# EAGLE schematic DarkScope (EAGLE 9.0.0)

## Sheet 1 of 19
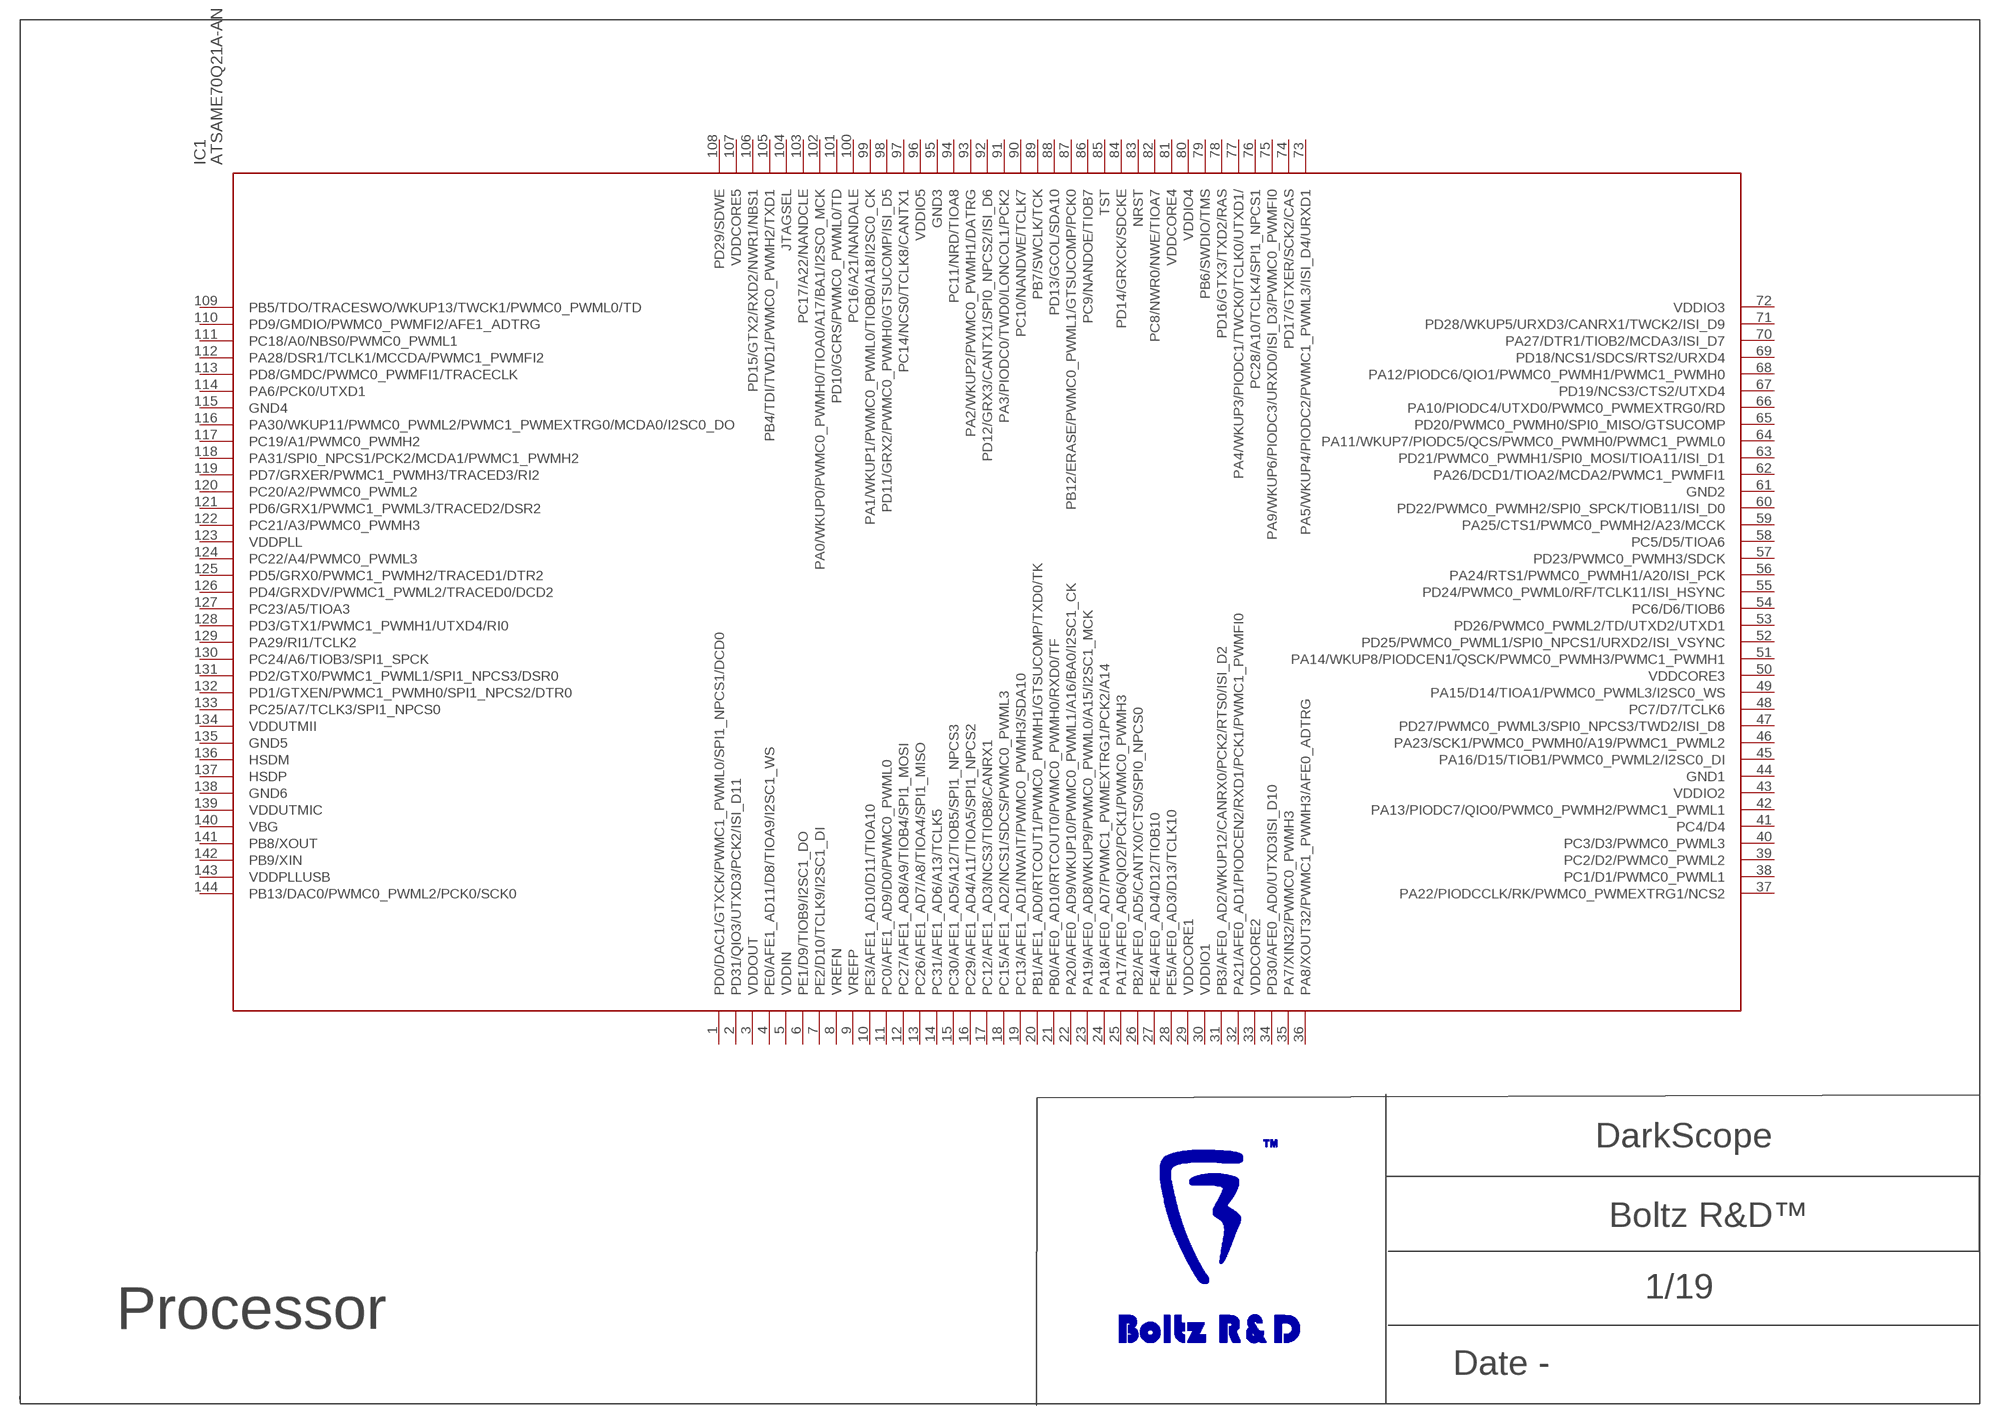
[diagram p0: schematic, sheet 1]

### Parts
IC1  ATSAME70Q21A-AN  [QFP50P2200X2200X160-144N]
Unconnected: IC1.1(PD0/DAC1/GTXCK/PWMC1_PWML0/SPI1_NPCS1/DCD0) IC1.2(PD31/QIO3/UTXD3/PCK2/ISI_D11) IC1.4(PE0/AFE1_AD11/D8/TIOA9/I2SC1_WS) IC1.6(PE1/D9/TIOB9/I2SC1_DO) IC1.7(PE2/D10/TCLK9/I2SC1_DI) IC1.8(VREFN) IC1.9(VREFP) IC1.10(PE3/AFE1_AD10/D11/TIOA10) IC1.11(PC0/AFE1_AD9/D0/PWMC0_PWML0) IC1.12(PC27/AFE1_AD8/A9/TIOB4/SPI1_MOSI) IC1.13(PC26/AFE1_AD7/A8/TIOA4/SPI1_MISO) IC1.14(PC31/AFE1_AD6/A13/TCLK5) IC1.15(PC30/AFE1_AD5/A12/TIOB5/SPI1_NPCS3) IC1.16(PC29/AFE1_AD4/A11/TIOA5/SPI1_NPCS2) IC1.17(PC12/AFE1_AD3/NCS3/TIOB8/CANRX1) IC1.18(PC15/AFE1_AD2/NCS1/SDCS/PWMC0_PWML3) IC1.19(PC13/AFE1_AD1/NWAIT/PWMC0_PWMH3/SDA10) IC1.20(PB1/AFE1_AD0/RTCOUT1/PWMC0_PWMH1/GTSUCOMP/TXD0/TK) IC1.21(PB0/AFE0_AD10/RTCOUT0/PWMC0_PWMH0/RXD0/TF) IC1.22(PA20/AFE0_AD9/WKUP10/PWMC0_PWML1/A16/BA0/I2SC1_CK) IC1.23(PA19/AFE0_AD8/WKUP9/PWMC0_PWML0/A15/I2SC1_MCK) IC1.24(PA18/AFE0_AD7/PWMC1_PWMEXTRG1/PCK2/A14) IC1.25(PA17/AFE0_AD6/QIO2/PCK1/PWMC0_PWMH3) IC1.26(PB2/AFE0_AD5/CANTX0/CTS0/SPI0_NPCS0) IC1.27(PE4/AFE0_AD4/D12/TIOB10) IC1.28(PE5/AFE0_AD3/D13/TCLK10) IC1.31(PB3/AFE0_AD2/WKUP12/CANRX0/PCK2/RTS0/ISI_D2) IC1.32(PA21/AFE0_AD1/PIODCEN2/RXD1/PCK1/PWMC1_PWMFI0) IC1.34(PD30/AFE0_AD0/UTXD3ISI_D10) IC1.35(PA7/XIN32/PWMC0_PWMH3) IC1.36(PA8/XOUT32/PWMC1_PWMH3/AFE0_ADTRG) IC1.37(PA22/PIODCCLK/RK/PWMC0_PWMEXTRG1/NCS2) IC1.38(PC1/D1/PWMC0_PWML1) IC1.39(PC2/D2/PWMC0_PWML2) IC1.40(PC3/D3/PWMC0_PWML3) IC1.41(PC4/D4) IC1.42(PA13/PIODC7/QIO0/PWMC0_PWMH2/PWMC1_PWML1) IC1.45(PA16/D15/TIOB1/PWMC0_PWML2/I2SC0_DI) IC1.46(PA23/SCK1/PWMC0_PWMH0/A19/PWMC1_PWML2) IC1.47(PD27/PWMC0_PWML3/SPI0_NPCS3/TWD2/ISI_D8) IC1.48(PC7/D7/TCLK6) IC1.49(PA15/D14/TIOA1/PWMC0_PWML3/I2SC0_WS) IC1.51(PA14/WKUP8/PIODCEN1/QSCK/PWMC0_PWMH3/PWMC1_PWMH1) IC1.52(PD25/PWMC0_PWML1/SPI0_NPCS1/URXD2/ISI_VSYNC) IC1.53(PD26/PWMC0_PWML2/TD/UTXD2/UTXD1) IC1.54(PC6/D6/TIOB6) IC1.55(PD24/PWMC0_PWML0/RF/TCLK11/ISI_HSYNC) IC1.56(PA24/RTS1/PWMC0_PWMH1/A20/ISI_PCK) IC1.57(PD23/PWMC0_PWMH3/SDCK) IC1.58(PC5/D5/TIOA6) IC1.59(PA25/CTS1/PWMC0_PWMH2/A23/MCCK) IC1.60(PD22/PWMC0_PWMH2/SPI0_SPCK/TIOB11/ISI_D0) IC1.62(PA26/DCD1/TIOA2/MCDA2/PWMC1_PWMFI1) IC1.63(PD21/PWMC0_PWMH1/SPI0_MOSI/TIOA11/ISI_D1) IC1.64(PA11/WKUP7/PIODC5/QCS/PWMC0_PWMH0/PWMC1_PWML0) IC1.65(PD20/PWMC0_PWMH0/SPI0_MISO/GTSUCOMP) IC1.66(PA10/PIODC4/UTXD0/PWMC0_PWMEXTRG0/RD) IC1.67(PD19/NCS3/CTS2/UTXD4) IC1.68(PA12/PIODC6/QIO1/PWMC0_PWMH1/PWMC1_PWMH0) IC1.69(PD18/NCS1/SDCS/RTS2/URXD4) IC1.70(PA27/DTR1/TIOB2/MCDA3/ISI_D7) IC1.71(PD28/WKUP5/URXD3/CANRX1/TWCK2/ISI_D9) IC1.73(PA5/WKUP4/PIODC2/PWMC1_PWML3/ISI_D4/URXD1) IC1.74(PD17/GTXER/SCK2/CAS) IC1.75(PA9/WKUP6/PIODC3/URXD0/ISI_D3/PWMC0_PWMFI0) IC1.76(PC28/A10/TCLK4/SPI1_NPCS1) IC1.77(PA4/WKUP3/PIODC1/TWCK0/TCLK0/UTXD1/) IC1.78(PD16/GTX3/TXD2/RAS) IC1.79(PB6/SWDIO/TMS) IC1.82(PC8/NWR0/NWE/TIOA7) IC1.83(NRST) IC1.84(PD14/GRXCK/SDCKE) IC1.85(TST) IC1.86(PC9/NANDOE/TIOB7) IC1.87(PB12/ERASE/PWMC0_PWML1/GTSUCOMP/PCK0) IC1.88(PD13/GCOL/SDA10) IC1.89(PB7/SWCLK/TCK) IC1.90(PC10/NANDWE/TCLK7) IC1.91(PA3/PIODC0/TWD0/LONCOL1/PCK2) IC1.92(PD12/GRX3/CANTX1/SPI0_NPCS2/ISI_D6) IC1.93(PA2/WKUP2/PWMC0_PWMH1/DATRG) IC1.94(PC11/NRD/TIOA8) IC1.97(PC14/NCS0/TCLK8/CANTX1) IC1.98(PD11/GRX2/PWMC0_PWMH0/GTSUCOMP/ISI_D5) IC1.99(PA1/WKUP1/PWMC0_PWML0/TIOB0/A18/I2SC0_CK) IC1.100(PC16/A21/NANDALE) IC1.101(PD10/GCRS/PWMC0_PWML0/TD) IC1.102(PA0/WKUP0/PWMC0_PWMH0/TIOA0/A17/BA1/I2SC0_MCK) IC1.103(PC17/A22/NANDCLE) IC1.104(JTAGSEL) IC1.105(PB4/TDI/TWD1/PWMC0_PWMH2/TXD1) IC1.106(PD15/GTX2/RXD2/NWR1/NBS1) IC1.108(PD29/SDWE) IC1.109(PB5/TDO/TRACESWO/WKUP13/TWCK1/PWMC0_PWML0/TD) IC1.110(PD9/GMDIO/PWMC0_PWMFI2/AFE1_ADTRG) IC1.111(PC18/A0/NBS0/PWMC0_PWML1) IC1.112(PA28/DSR1/TCLK1/MCCDA/PWMC1_PWMFI2) IC1.113(PD8/GMDC/PWMC0_PWMFI1/TRACECLK) IC1.114(PA6/PCK0/UTXD1) IC1.116(PA30/WKUP11/PWMC0_PWML2/PWMC1_PWMEXTRG0/MCDA0/I2SC0_DO) IC1.117(PC19/A1/PWMC0_PWMH2) IC1.118(PA31/SPI0_NPCS1/PCK2/MCDA1/PWMC1_PWMH2) IC1.119(PD7/GRXER/PWMC1_PWMH3/TRACED3/RI2) IC1.120(PC20/A2/PWMC0_PWML2) IC1.121(PD6/GRX1/PWMC1_PWML3/TRACED2/DSR2) IC1.122(PC21/A3/PWMC0_PWMH3) IC1.124(PC22/A4/PWMC0_PWML3) IC1.125(PD5/GRX0/PWMC1_PWMH2/TRACED1/DTR2) IC1.126(PD4/GRXDV/PWMC1_PWML2/TRACED0/DCD2) IC1.127(PC23/A5/TIOA3) IC1.128(PD3/GTX1/PWMC1_PWMH1/UTXD4/RI0) IC1.129(PA29/RI1/TCLK2) IC1.130(PC24/A6/TIOB3/SPI1_SPCK) IC1.131(PD2/GTX0/PWMC1_PWML1/SPI1_NPCS3/DSR0) IC1.132(PD1/GTXEN/PWMC1_PWMH0/SPI1_NPCS2/DTR0) IC1.133(PC25/A7/TCLK3/SPI1_NPCS0) IC1.136(HSDM) IC1.137(HSDP) IC1.140(VBG) IC1.141(PB8/XOUT) IC1.142(PB9/XIN) IC1.144(PB13/DAC0/PWMC0_PWML2/PCK0/SCK0)

### Notes on the sheet
- Processor

## Sheet 2 of 19
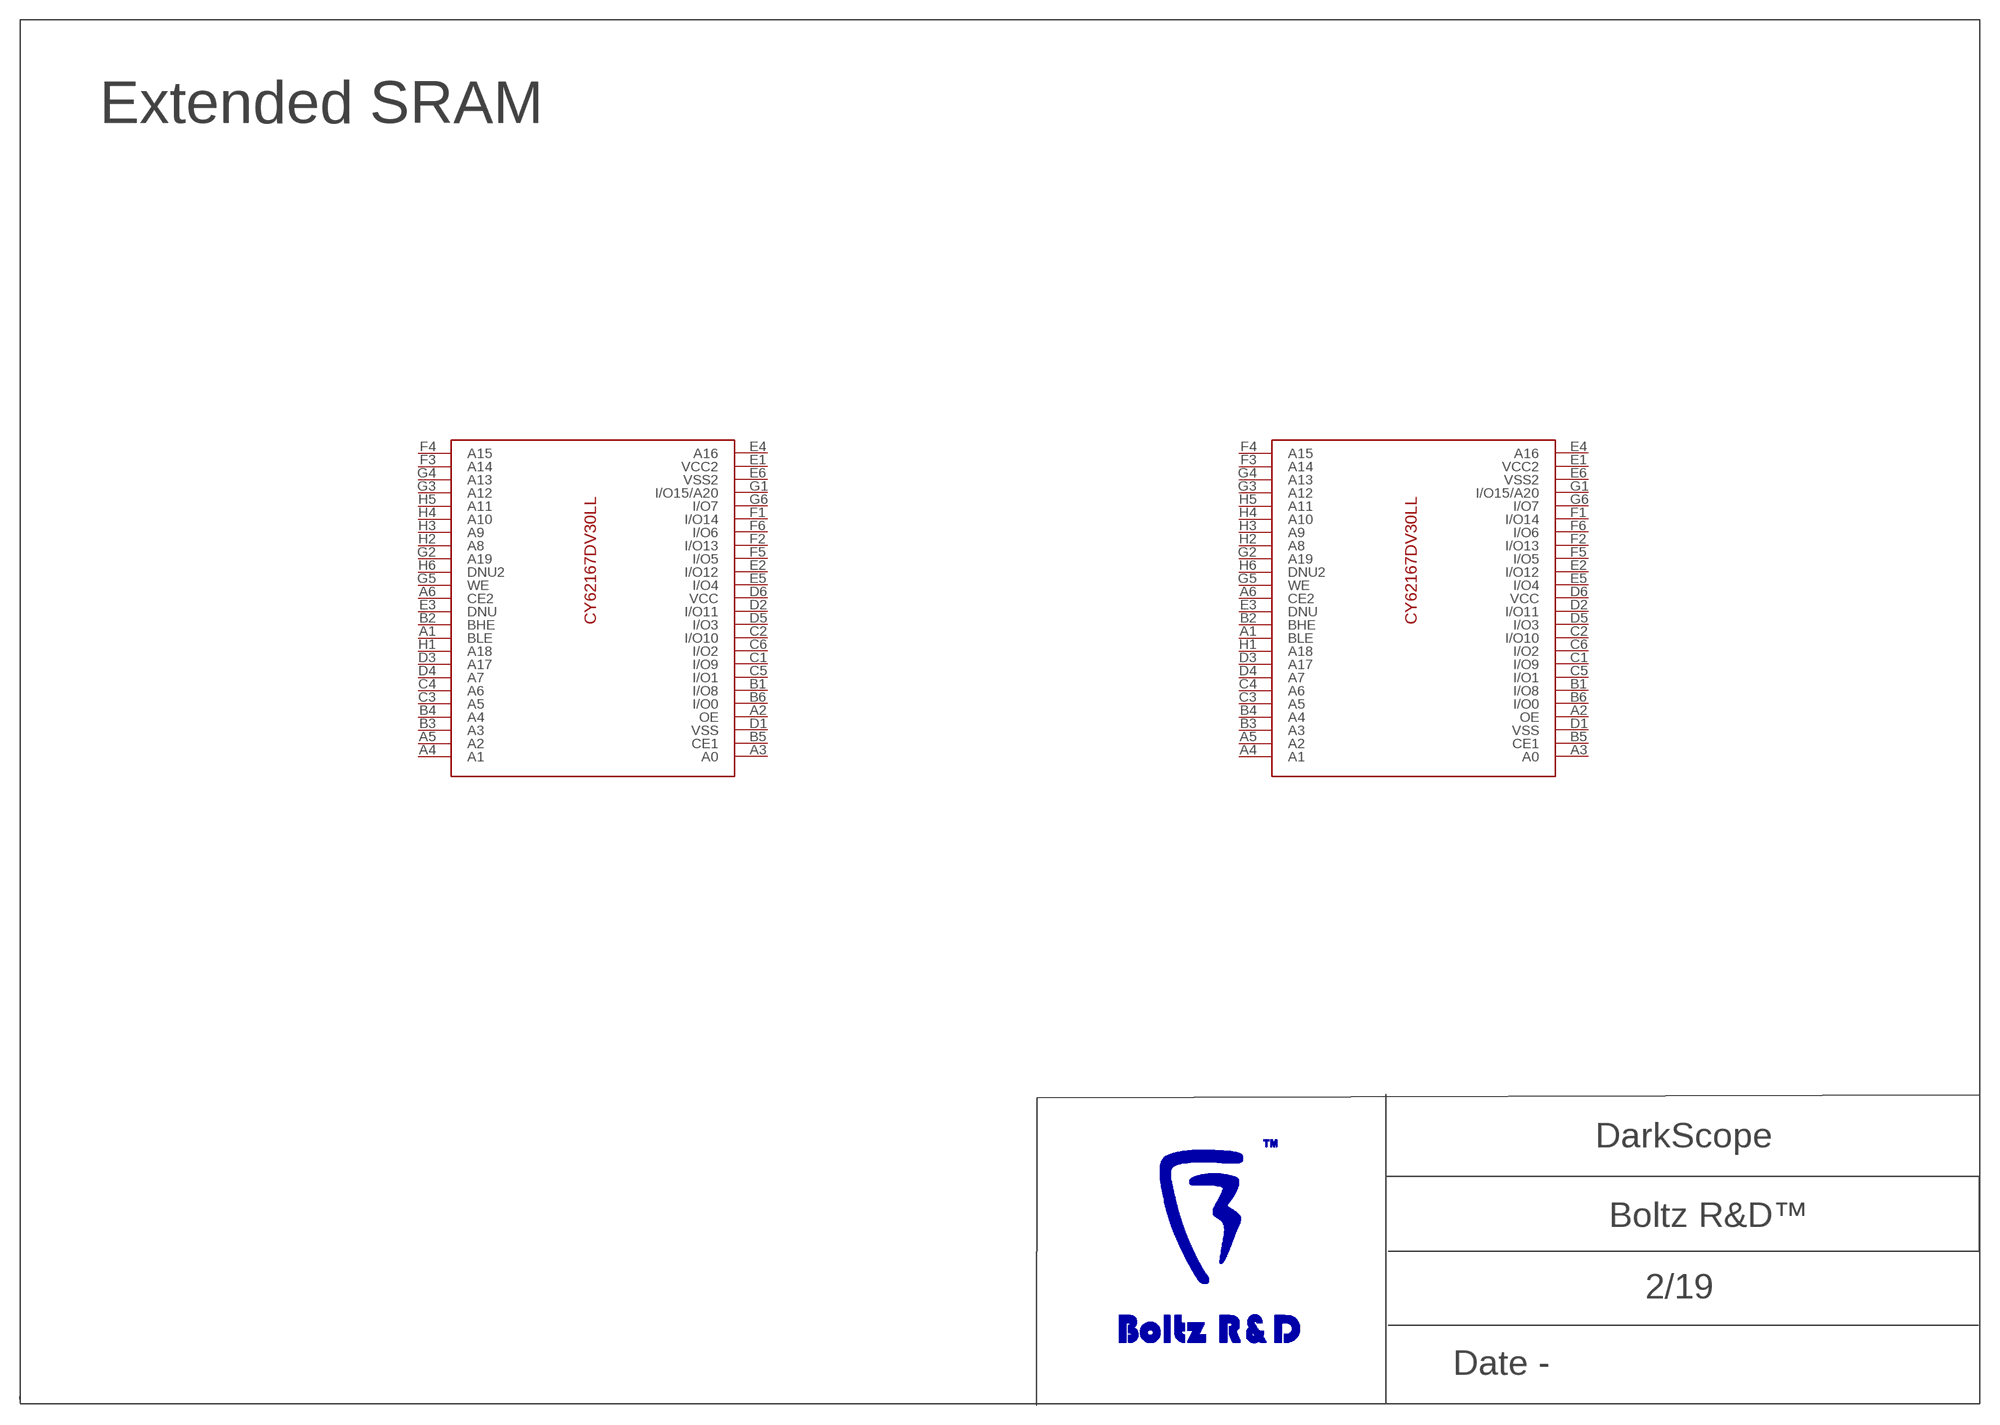
[diagram p1: schematic, sheet 2]

### Parts
U$22  CY62167DV30LLCY62167DV30LL-55BVI  [BGA48C75P6X8_950X800X100]
U$23  CY62167DV30LLCY62167DV30LL-55BVI  [BGA48C75P6X8_950X800X100]
Unconnected: U$22.A1(BLE) U$22.A2(OE) U$22.A3(A0) U$22.A4(A1) U$22.A5(A2) U$22.A6(CE2) U$22.B1(I/O8) U$22.B2(BHE) U$22.B3(A3) U$22.B4(A4) U$22.B5(CE1) U$22.B6(I/O0) U$22.C1(I/O9) U$22.C2(I/O10) U$22.C3(A5) U$22.C4(A6) U$22.C5(I/O1) U$22.C6(I/O2) U$22.D1(VSS) U$22.D2(I/O11) U$22.D3(A17) U$22.D4(A7) U$22.D5(I/O3) U$22.D6(VCC) U$22.E1(VCC2) U$22.E2(I/O12) U$22.E3(DNU) U$22.E4(A16) U$22.E5(I/O4) U$22.E6(VSS2) U$22.F1(I/O14) U$22.F2(I/O13) U$22.F3(A14) U$22.F4(A15) U$22.F5(I/O5) U$22.F6(I/O6) U$22.G1(I/O15/A20) U$22.G2(A19) U$22.G3(A12) U$22.G4(A13) U$22.G5(WE) U$22.G6(I/O7) U$22.H1(A18) U$22.H2(A8) U$22.H3(A9) U$22.H4(A10) U$22.H5(A11) U$22.H6(DNU2) U$23.A1(BLE) U$23.A2(OE) U$23.A3(A0) U$23.A4(A1) U$23.A5(A2) U$23.A6(CE2) U$23.B1(I/O8) U$23.B2(BHE) U$23.B3(A3) U$23.B4(A4) U$23.B5(CE1) U$23.B6(I/O0) U$23.C1(I/O9) U$23.C2(I/O10) U$23.C3(A5) U$23.C4(A6) U$23.C5(I/O1) U$23.C6(I/O2) U$23.D1(VSS) U$23.D2(I/O11) U$23.D3(A17) U$23.D4(A7) U$23.D5(I/O3) U$23.D6(VCC) U$23.E1(VCC2) U$23.E2(I/O12) U$23.E3(DNU) U$23.E4(A16) U$23.E5(I/O4) U$23.E6(VSS2) U$23.F1(I/O14) U$23.F2(I/O13) U$23.F3(A14) U$23.F4(A15) U$23.F5(I/O5) U$23.F6(I/O6) U$23.G1(I/O15/A20) U$23.G2(A19) U$23.G3(A12) U$23.G4(A13) U$23.G5(WE) U$23.G6(I/O7) U$23.H1(A18) U$23.H2(A8) U$23.H3(A9) U$23.H4(A10) U$23.H5(A11) U$23.H6(DNU2)

### Notes on the sheet
- Extended SRAM

## Sheet 3 of 19
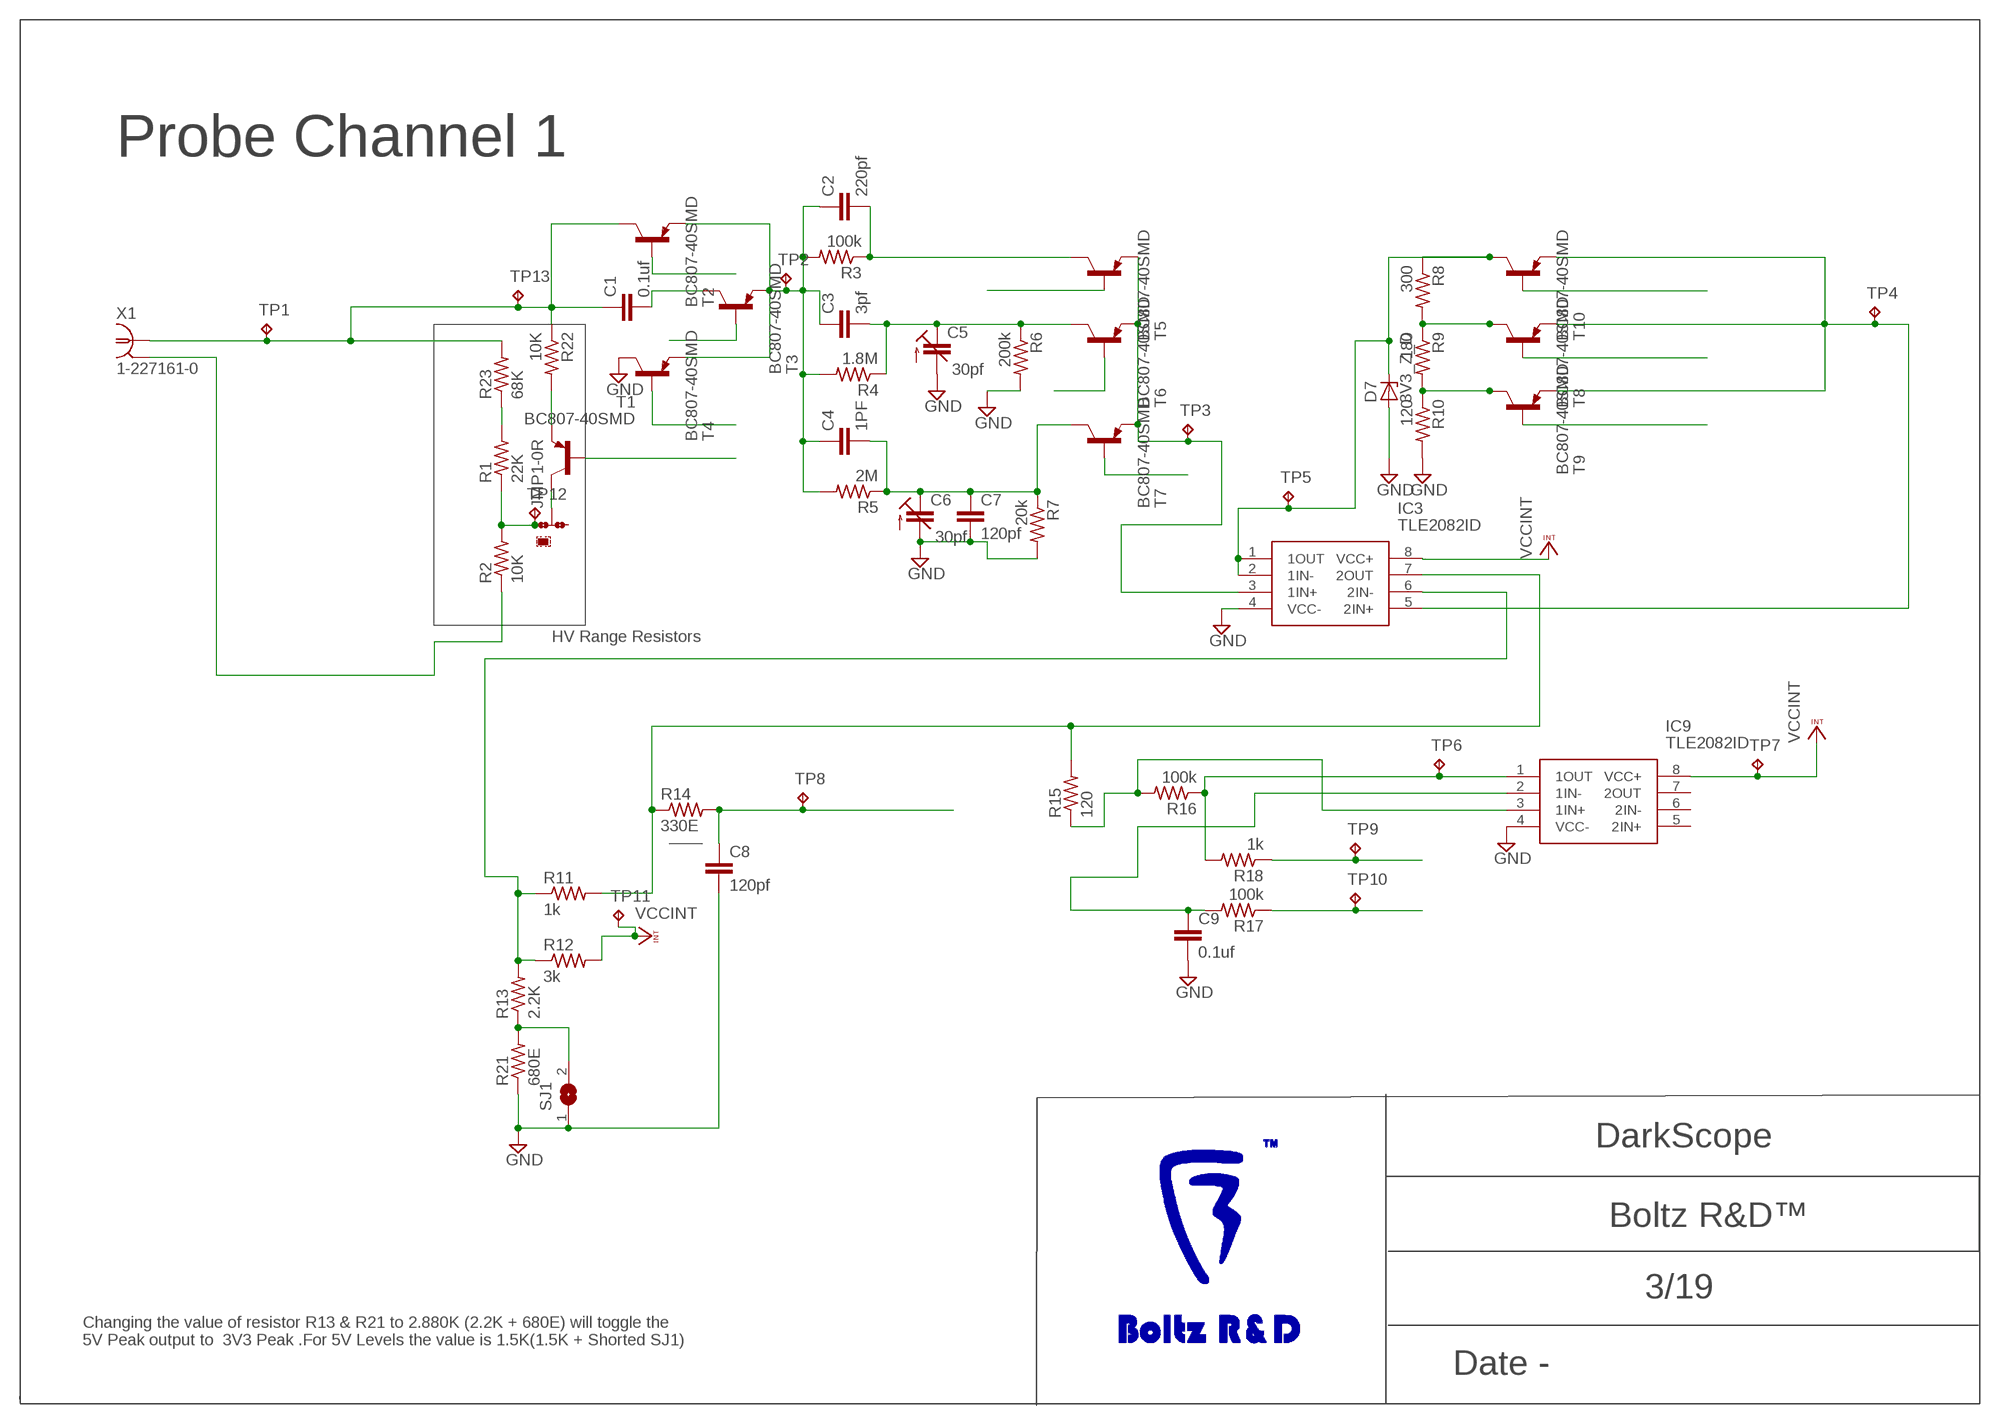
[diagram p2: schematic, sheet 3]

### Parts
C1  0.1uf  C-EUC0603  [C0603]
C2  220pf  C-EUC0603  [C0603]
C3  3pf  C-EUC0603  [C0603]
C4  1PF  C-EUC0603  [C0603]
C5  30pf  C-TRIMM3018_11  [CTRIM3018_11]
C6  30pf  C-TRIMM3018_11  [CTRIM3018_11]
C7  120pf  C-EUC0603  [C0603]
C8  120pf  C-EUC0603  [C0603]
C9  0.1uf  C-EUC0603  [C0603]
D7  3V3_Z_D  ZENER-DIODESOD80C  [SOD80C]
IC3  TLE2082ID  [SOIC127P600X175-8N]
IC9  TLE2082ID  [SOIC127P600X175-8N]
JMP1  0R-JUMPC  [C0R-JMP]
R1  22K  R-US_R0603  [R0603]
R2  10K  R-US_R0603  [R0603]
R3  100k  R-US_R0603  [R0603]
R4  1.8M  R-US_R0603  [R0603]
R5  2M  R-US_R0603  [R0603]
R6  200k  R-US_R0603  [R0603]
R7  20k  R-US_R0603  [R0603]
R8  300  R-US_R0603  [R0603]
R9  180  R-US_R0603  [R0603]
R10  120  R-US_R0603  [R0603]
R11  1k  R-US_R0603  [R0603]
R12  3k  R-US_R0603  [R0603]
R13  2.2K  R-US_R0603  [R0603]
R14  330E  R-US_R0603  [R0603]
R15  120  R-US_R0603  [R0603]
R16  100k  R-US_R0603  [R0603]
R17  100k  R-US_R0603  [R0603]
R18  1k  R-US_R0603  [R0603]
R21  680E  R-US_R0603  [R0603]
R22  10K  R-US_R0603  [R0603]
R23  68K  R-US_R0603  [R0603]
SJ1  SJ  [SJ]
T1  BC807-40SMD  [SOT23-BEC]
T2  BC807-40SMD  [SOT23-BEC]
T3  BC807-40SMD  [SOT23-BEC]
T4  BC807-40SMD  [SOT23-BEC]
T5  BC807-40SMD  [SOT23-BEC]
T6  BC807-40SMD  [SOT23-BEC]
T7  BC807-40SMD  [SOT23-BEC]
T8  BC807-40SMD  [SOT23-BEC]
T9  BC807-40SMD  [SOT23-BEC]
T10  BC807-40SMD  [SOT23-BEC]
TP1  TPTP07R  [TP07R]
TP2  TPTP07R  [TP07R]
TP3  TPTP07R  [TP07R]
TP4  TPTP07R  [TP07R]
TP5  TPTP07R  [TP07R]
TP6  TPTP07R  [TP07R]
TP7  TPTP07R  [TP07R]
TP8  TPTP07R  [TP07R]
TP9  TPTP07R  [TP07R]
TP10  TPTP07R  [TP07R]
TP11  TPTP07R  [TP07R]
TP12  TPTP07R  [TP07R]
TP13  TPTP07R  [TP07R]
X1  1-227161-0  [AMP_227161]

### Nets
+5V/1: IC3.8(VCC+) IC9.8(VCC+) R12.2 TP7.TP TP11.TP ; supply symbol labelled VCCINT ; also sheet 11
GND: C5.-(A) C6.-(A) C7.2 C8.2 C9.2 D7.A IC3.4(VCC-) IC9.4(VCC-) R6.2 R7.2 R10.2 R21.1 SJ1.1 T4.C ; also sheet 9,10,11
N$1: R2.1 X1.2
N$2: JMP1.1 R1.1 R2.2 TP12.TP
N$3: C1.2 T3.C
N$4: T1.B
N$5: R8.2 R9.1 T8.C
N$6: C1.1 R22.1 R23.2 T2.C TP1.TP TP13.TP X1.1
N$7: T10.B
N$8: C2.1 C3.1 C4.1 R3.2 R4.2 R5.2 T2.E T3.E T4.E TP2.TP
N$9: C4.2 C6.+(E) C7.1 R5.1 R7.1 T7.C
N$10: C2.2 R3.1 T5.C
N$11: C3.2 C5.+(E) R4.1 R6.1 T6.C
N$12: R9.2 R10.1 T9.C
N$13: IC3.3(1IN+) T5.E T6.E T7.E TP3.TP
N$15: T5.B
N$16: T6.B
N$17: T7.B
N$18: T4.B
N$19: T3.B
N$20: T2.B
N$21: IC3.5(2IN+) T8.E T9.E T10.E TP4.TP
N$22: IC3.6(2IN-) R11.1 R12.1 R13.2
N$23: IC3.7(2OUT) R11.2 R14.1 R15.2
N$24: C8.1 R14.2 TP8.TP
N$25: IC9.3(1IN+) R15.1 R16.2
N$26: IC9.1(1OUT) R16.1 R18.2 TP6.TP
N$27: C9.1 IC9.2(1IN-) R17.2
N$28: R17.1 TP10.TP
N$29: R18.1 TP9.TP
N$30: D7.C IC3.1(1OUT) IC3.2(1IN-) R8.1 T10.C TP5.TP
N$34: R13.1 R21.2 SJ1.2
N$35: T8.B
N$36: R22.2 T1.E
N$37: R1.2 R23.1
N$38: JMP1.2 T1.C
N$39: T9.B
Unconnected: IC9.5(2IN+) IC9.6(2IN-) IC9.7(2OUT) JMP1.3

### Notes on the sheet
- Probe Channel 1
- HV Range Resistors
- Changing the value of resistor R13 & R21 to 2.880K (2.2K + 680E) will toggle the 
  5V Peak output to  3V3 Peak .For 5V Levels the value is 1.5K(1.5K + Shorted SJ1)

## Sheet 4 of 19

## Sheet 5 of 19

## Sheet 6 of 19

## Sheet 7 of 19
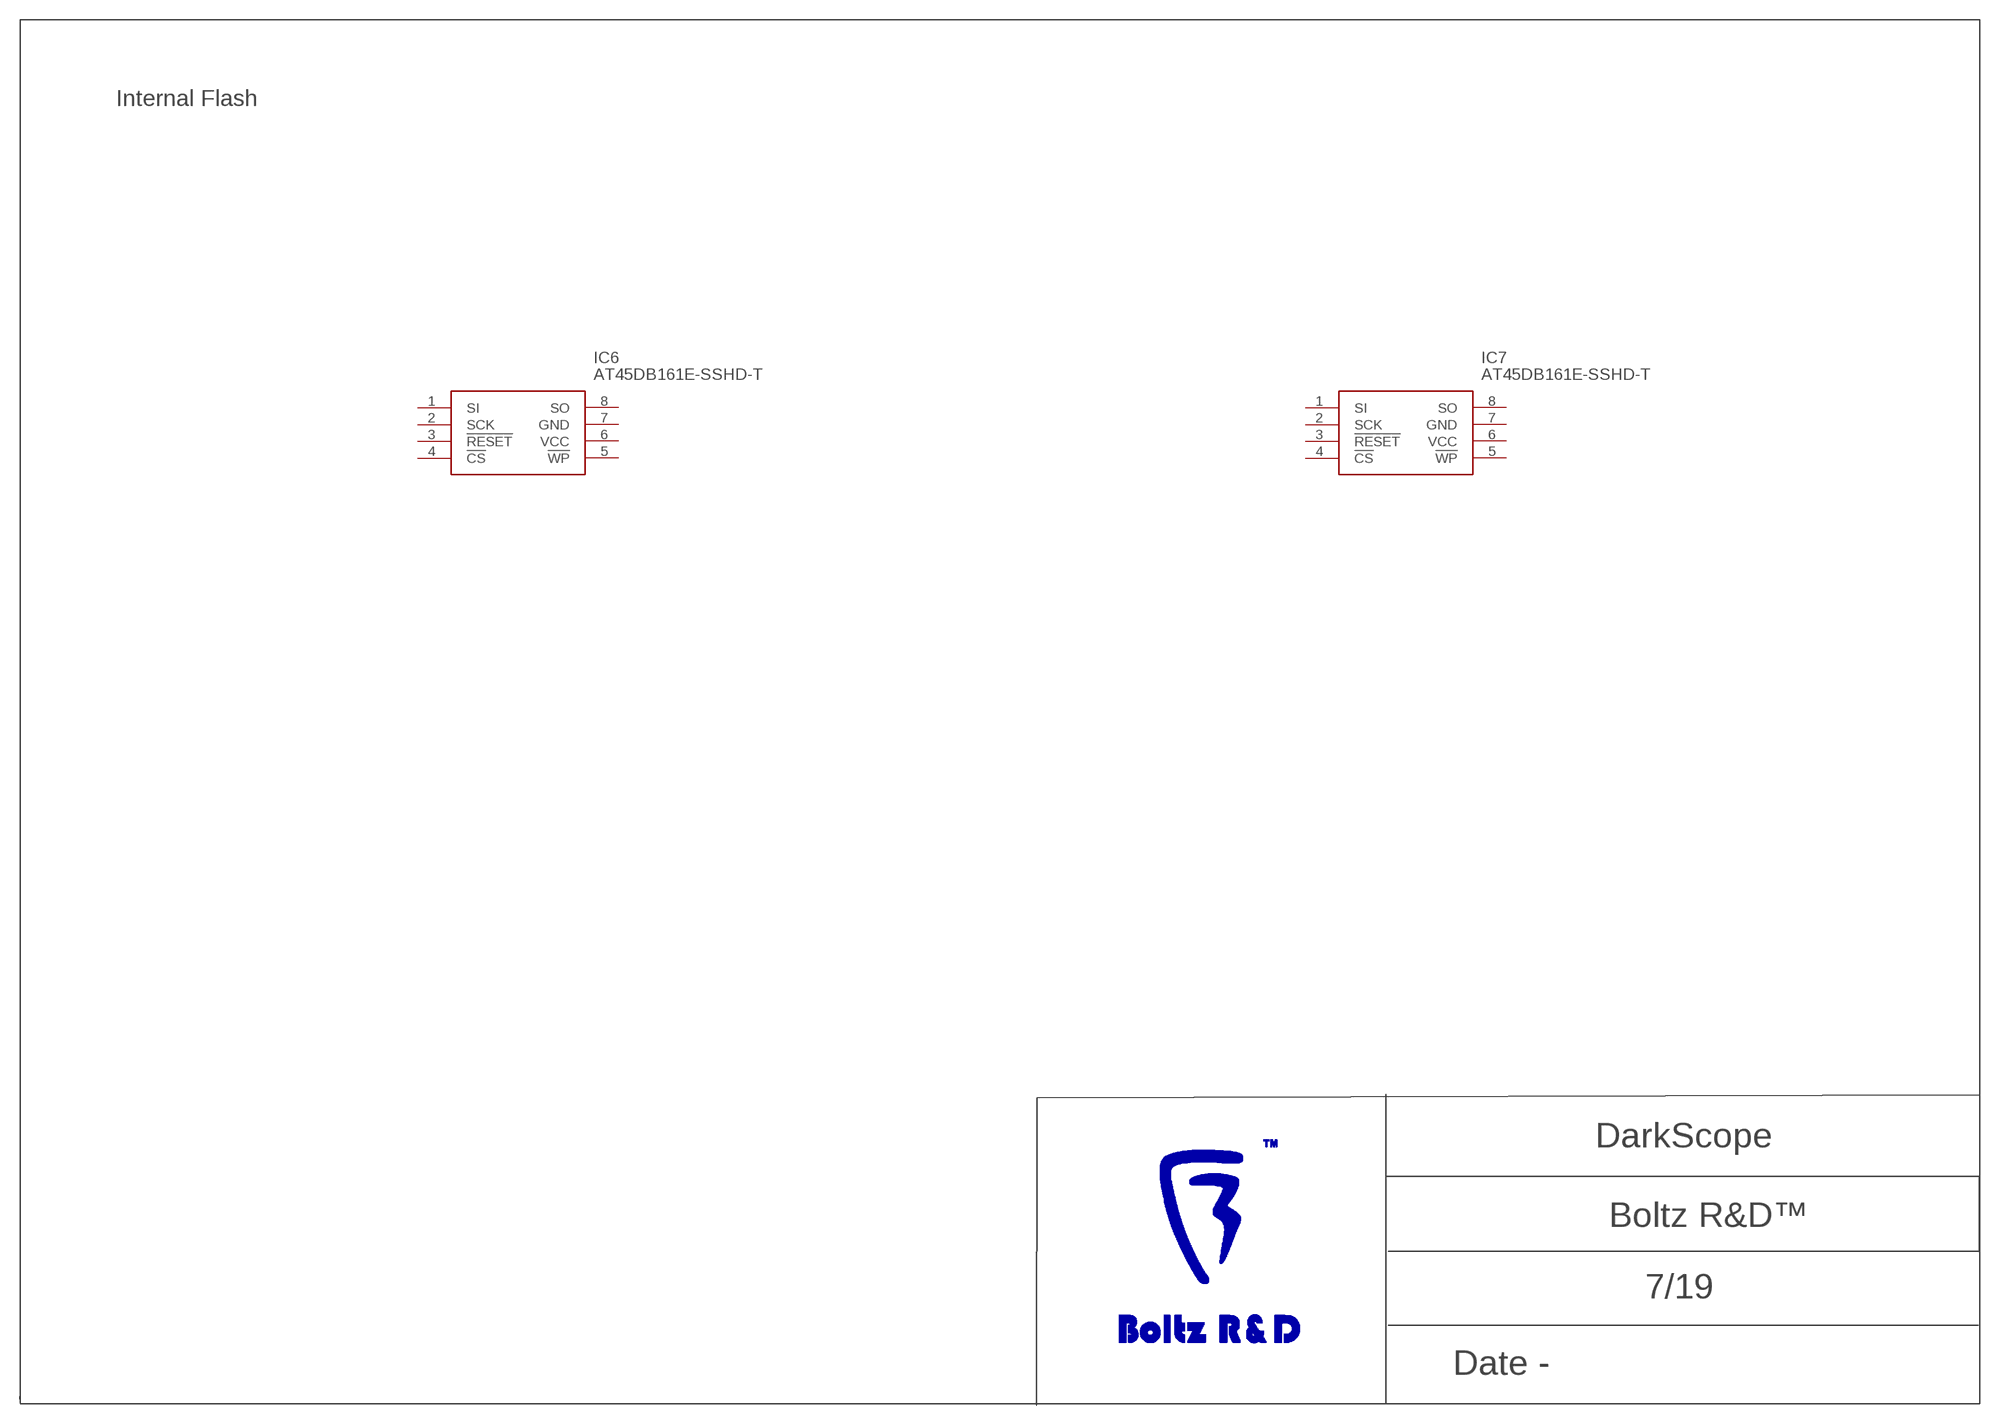
[diagram p3: schematic, sheet 7]

### Parts
IC6  AT45DB161E-SSHD-T  [SOIC127P600X175-8N]
IC7  AT45DB161E-SSHD-T  [SOIC127P600X175-8N]
Unconnected: IC6.1(SI) IC6.2(SCK) IC6.3(!RESET) IC6.4(!CS) IC6.5(!WP) IC6.6(VCC) IC6.7(GND) IC6.8(SO) IC7.1(SI) IC7.2(SCK) IC7.3(!RESET) IC7.4(!CS) IC7.5(!WP) IC7.6(VCC) IC7.7(GND) IC7.8(SO)

### Notes on the sheet
- Internal Flash

## Sheet 8 of 19
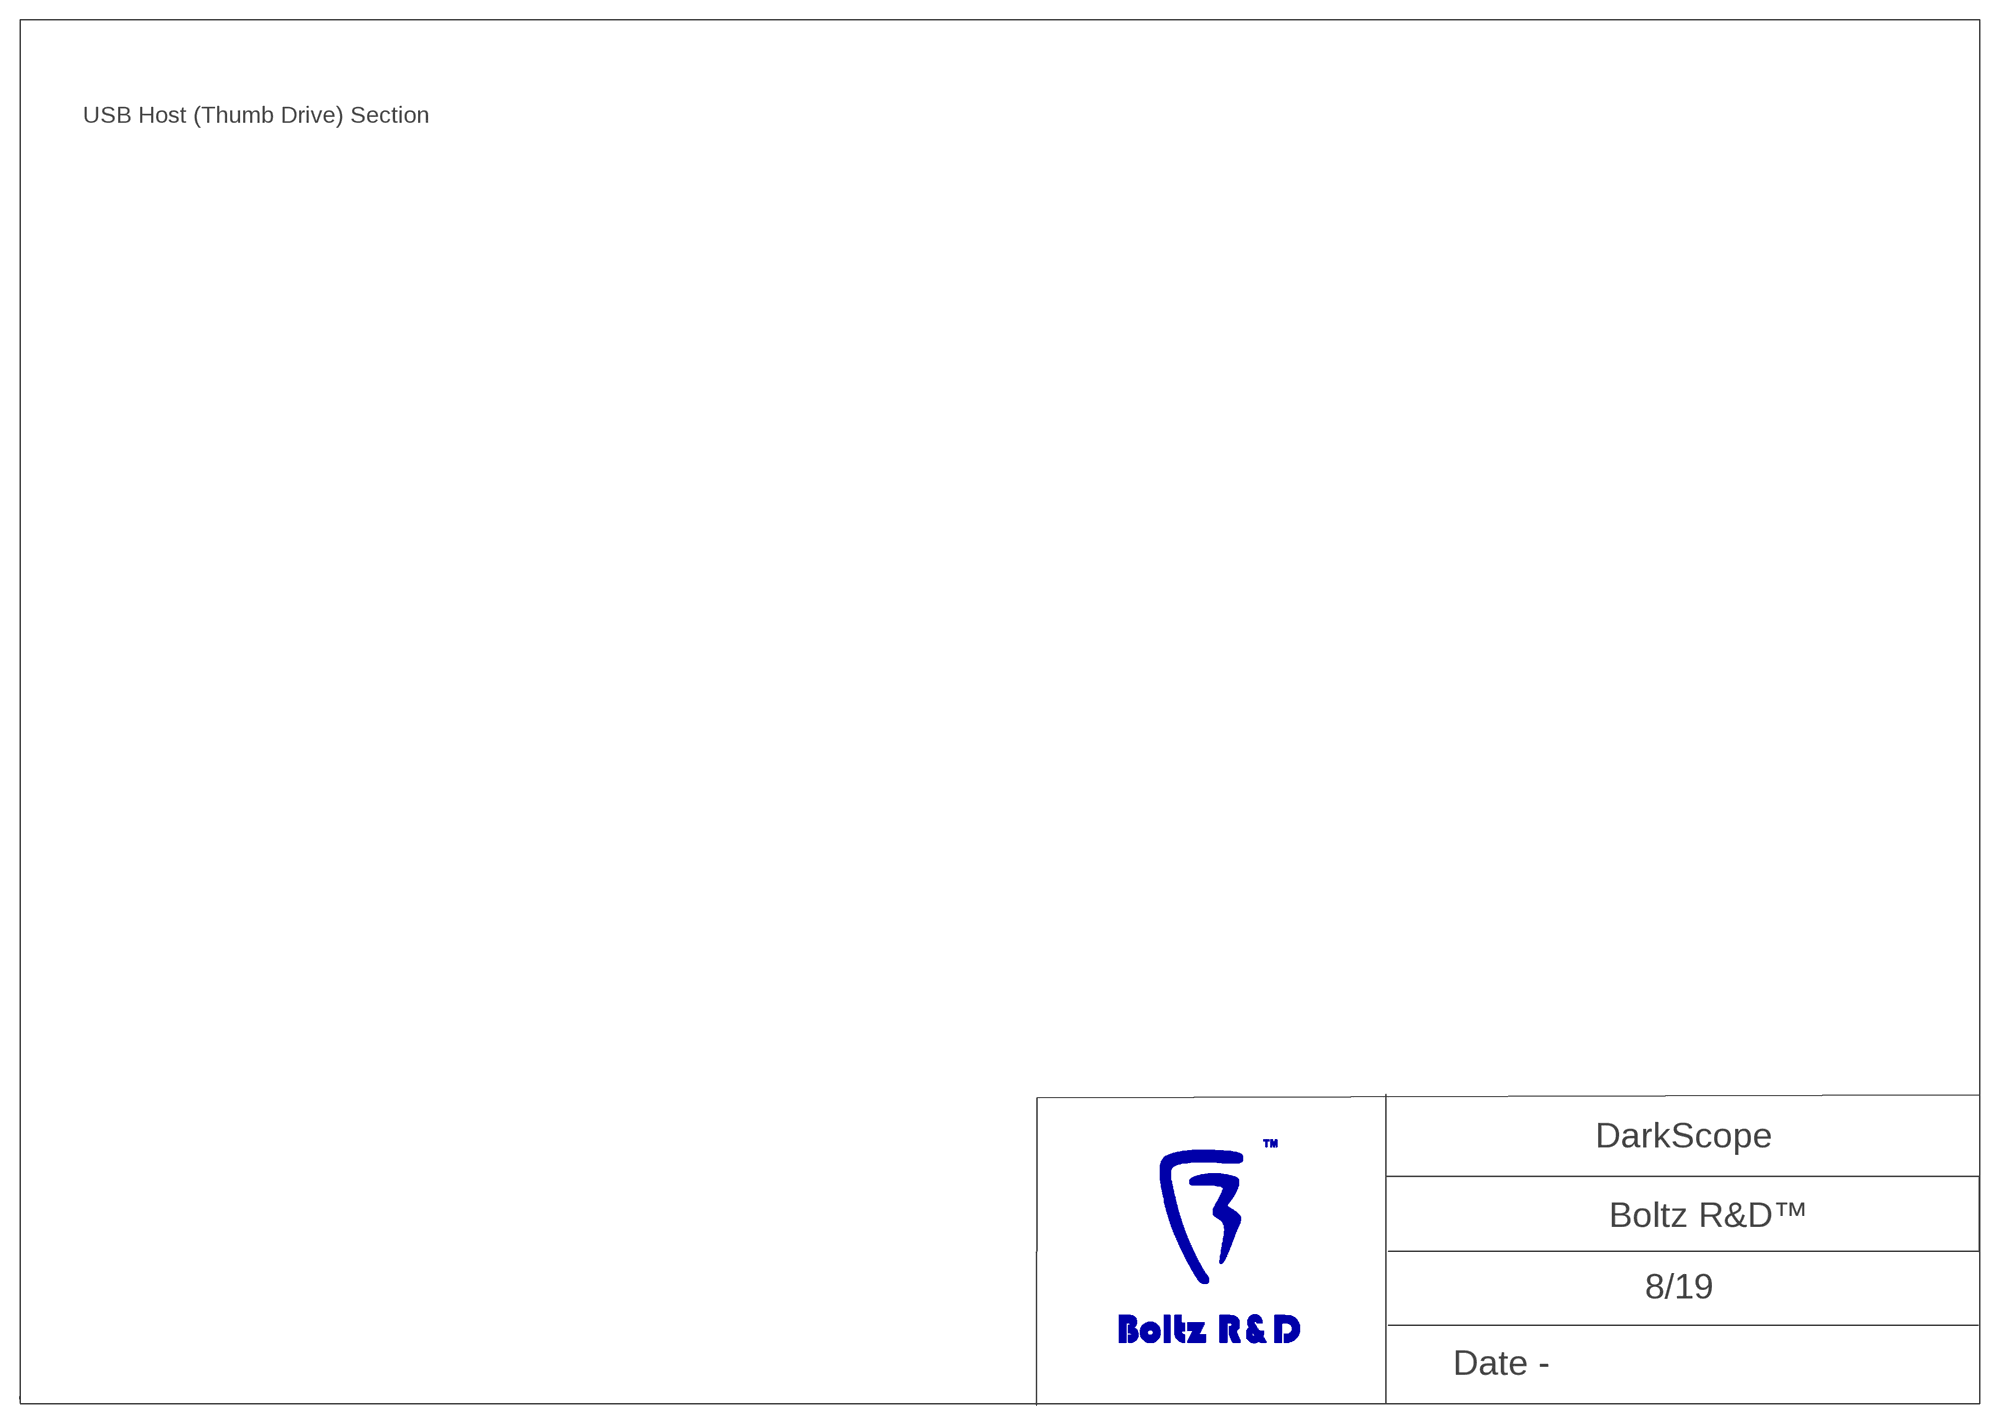
[diagram p4: schematic, sheet 8]

### Notes on the sheet
- USB Host (Thumb Drive) Section

## Sheet 9 of 19
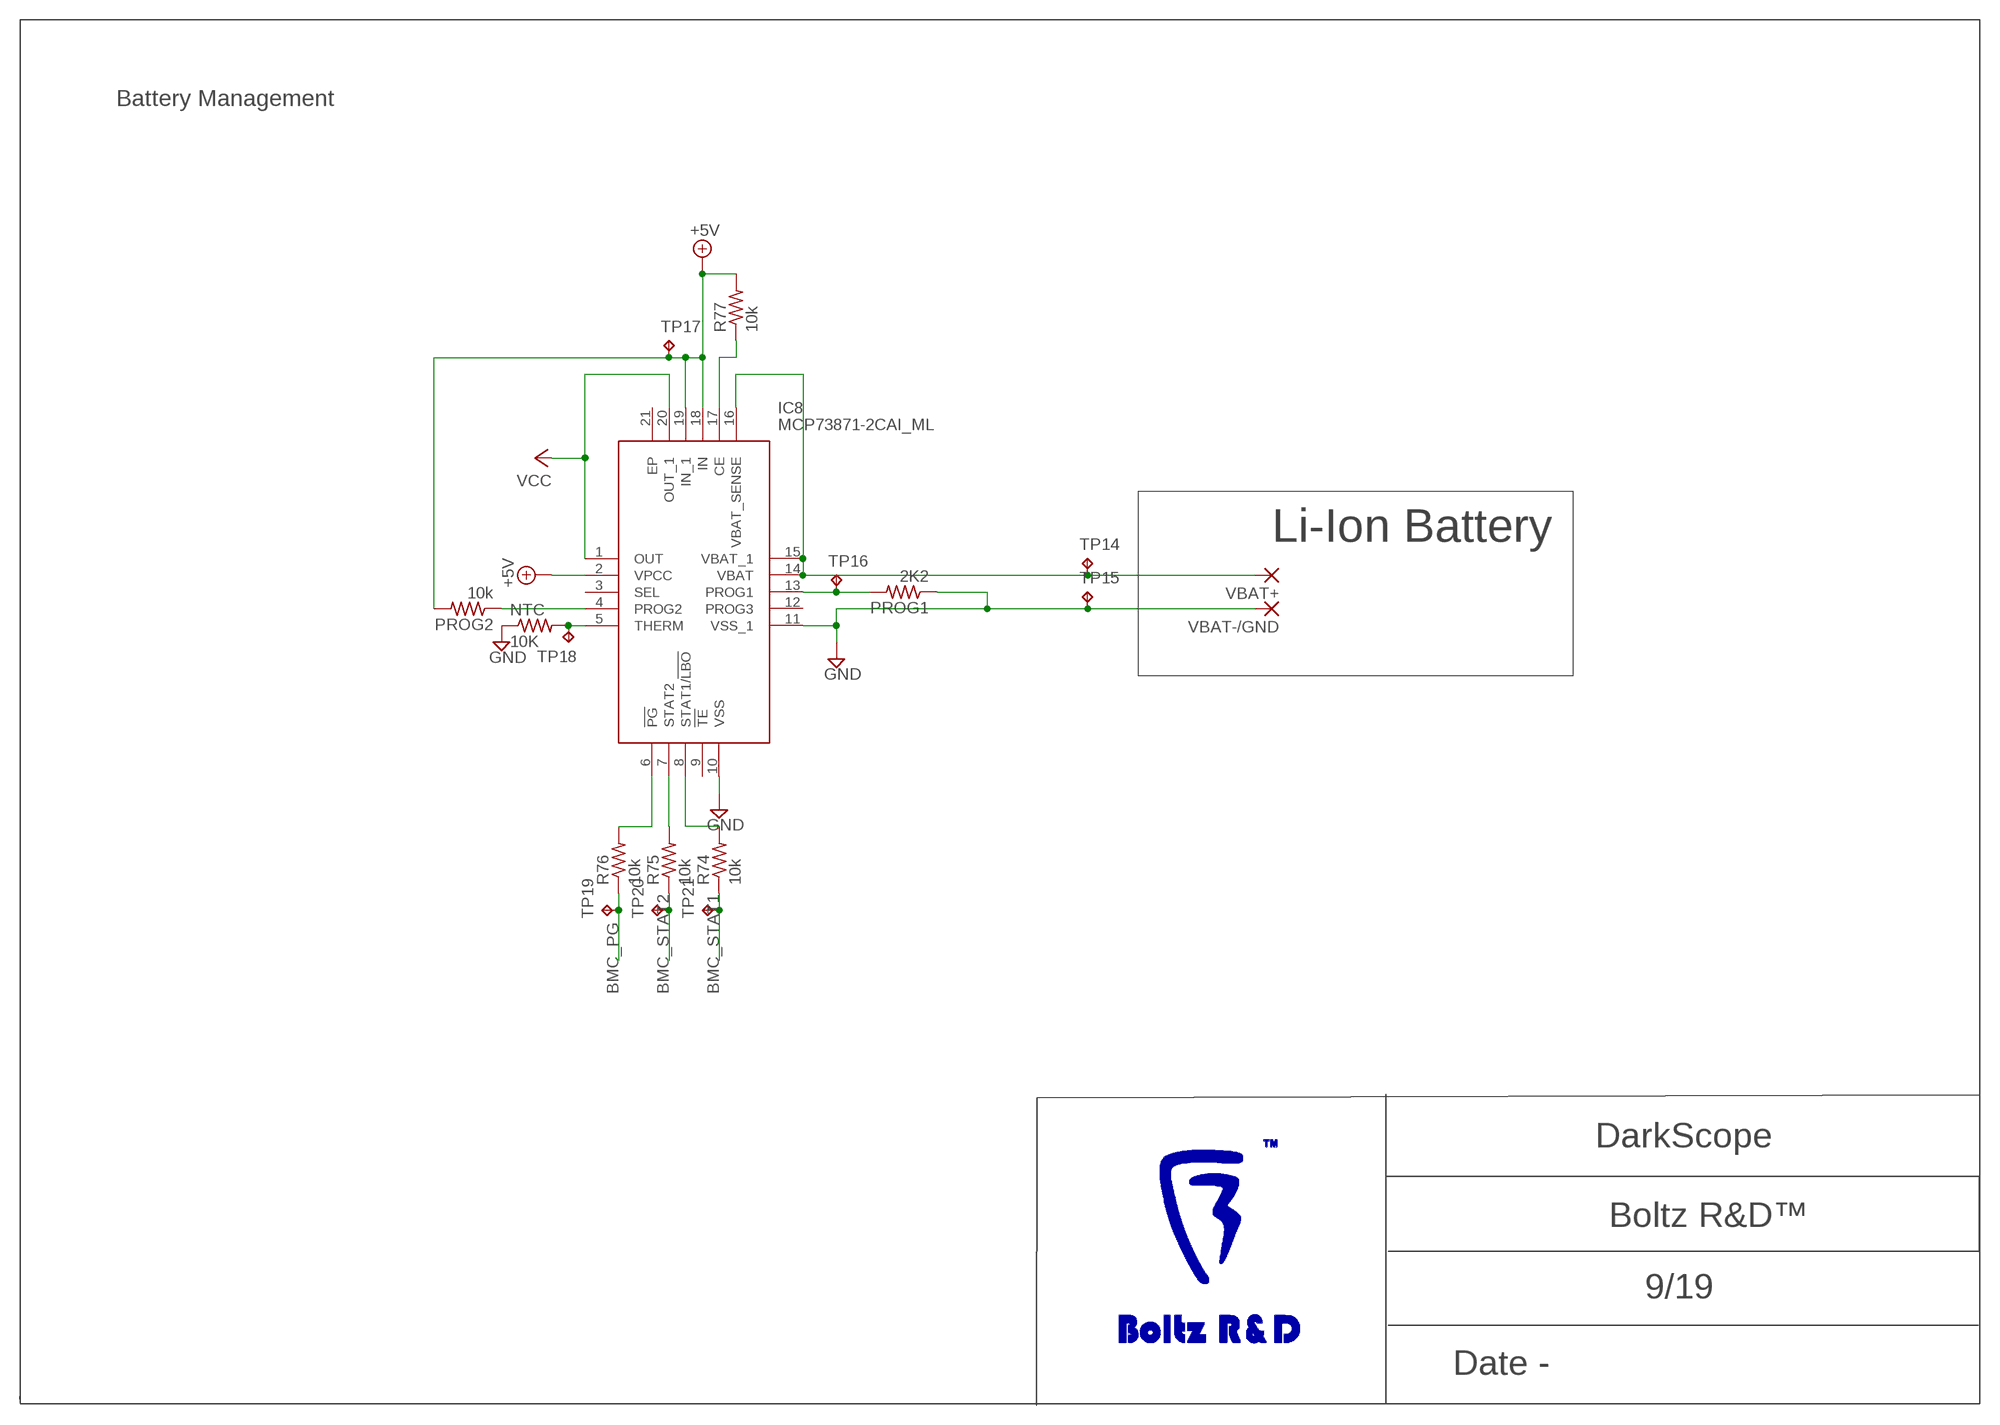
[diagram p5: schematic, sheet 9]

### Parts
IC8  MCP73871-2CAI_ML  [QFN50P400X400X100-21N]
NTC  10K  R-US_R0603  [R0603]
PROG1  2K2  R-US_R0603  [R0603]
PROG2  10k  R-US_R0603  [R0603]
R74  10k  R-US_R0603  [R0603]
R75  10k  R-US_R0603  [R0603]
R76  10k  R-US_R0603  [R0603]
R77  10k  R-US_R0603  [R0603]
TP14  TPTP07R  [TP07R]
TP15  TPTP07R  [TP07R]
TP16  TPTP07R  [TP07R]
TP17  TPTP07R  [TP07R]
TP18  TPTP07R  [TP07R]
TP19  TPTP07R  [TP07R]
TP20  TPTP07R  [TP07R]
TP21  TPTP07R  [TP07R]
VBAT+  SMD5  [SMD2,54-5,08]
VBAT-/GND  SMD5  [SMD2,54-5,08]

### Nets
+5V: IC8.2(VPCC) IC8.18(IN) IC8.19(IN_1) PROG2.2 R77.2 TP17.TP ; also sheet 10
BMC_PG: R76.1 TP19.TP
BMC_STAT1: R74.1 TP21.TP
BMC_STAT2: R75.1 TP20.TP
GND: IC8.10(VSS) IC8.11(VSS_1) PROG1.1 TP15.TP VBAT-/GND.1(P) ; also sheet 3,10,11
N$117: IC8.8(STAT1/!LBO) R74.2
N$118: IC8.5(THERM) NTC.2 TP18.TP
N$119: IC8.6(!PG) R76.2
N$120: IC8.7(STAT2) R75.2
N$121: IC8.13(PROG1) PROG1.2 TP16.TP
N$122: IC8.14(VBAT) IC8.15(VBAT_1) IC8.16(VBAT_SENSE) TP14.TP VBAT+.1(P)
N$123: IC8.4(PROG2) PROG2.1
N$124: IC8.17(CE) R77.1
VCC: IC8.1(OUT) IC8.20(OUT_1) ; also sheet 11
Unconnected: IC8.3(SEL) IC8.9(!TE) IC8.12(PROG3) IC8.21(EP) NTC.1

### Notes on the sheet
- Battery Management
- Li-Ion Battery

## Sheet 10 of 19
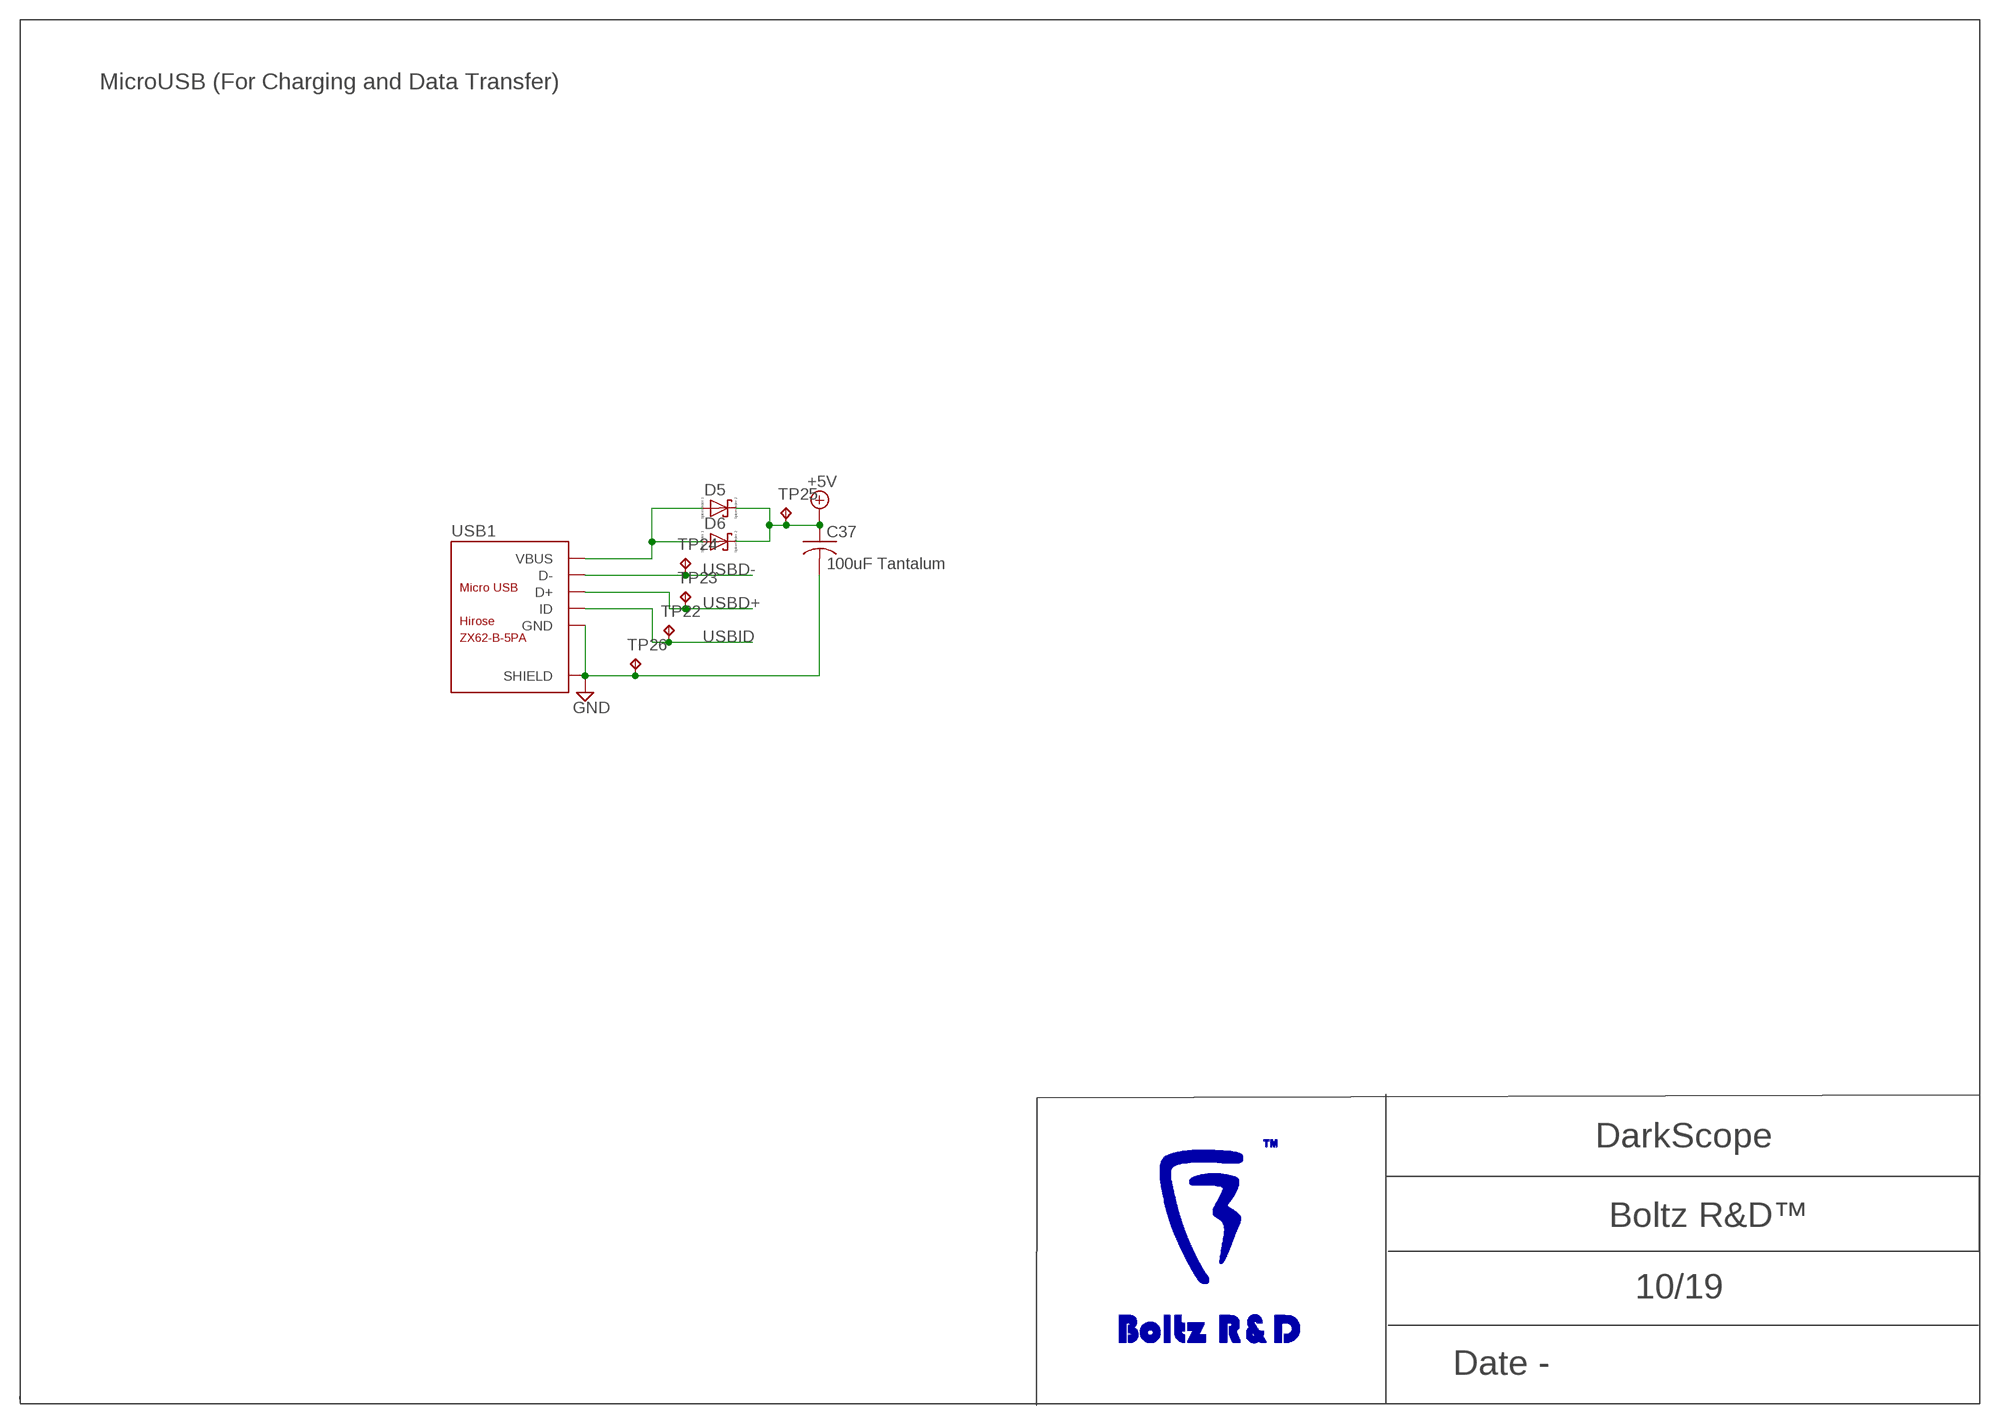
[diagram p6: schematic, sheet 10]

### Parts
C37  100uF Tantalum  C-USC1206  [C1206]
D5  SCHOTTKY-DIODESMC  [DIODE_SMC]
D6  SCHOTTKY-DIODESMC  [DIODE_SMC]
TP22  TPTP07R  [TP07R]
TP23  TPTP07R  [TP07R]
TP24  TPTP07R  [TP07R]
TP25  TPTP07R  [TP07R]
TP26  TPTP07R  [TP07R]
USB1  ZX62-B-5PA  MICRO-USB-SMD(ZX62-B-5PA)  [MICRO-USB5+6P-SMD-0.65-AB]

### Nets
+5V: C37.1 D5.C(A) D6.C(A) TP25.TP ; also sheet 9
GND: C37.2 TP26.TP USB1.5(GND) USB1.P1(SHIELD) USB1.P2(SHIELD) USB1.P3(SHIELD) USB1.P4(SHIELD) USB1.P5(SHIELD) USB1.P6(SHIELD) ; also sheet 3,9,11
USBD+: TP23.TP USB1.3(D+)
USBD-: TP24.TP USB1.2(D-)
USBID: TP22.TP USB1.4(ID)
VBUS: D5.A(C) D6.A(C) USB1.1(VBUS)

### Notes on the sheet
- MicroUSB (For Charging and Data Transfer)

## Sheet 11 of 19
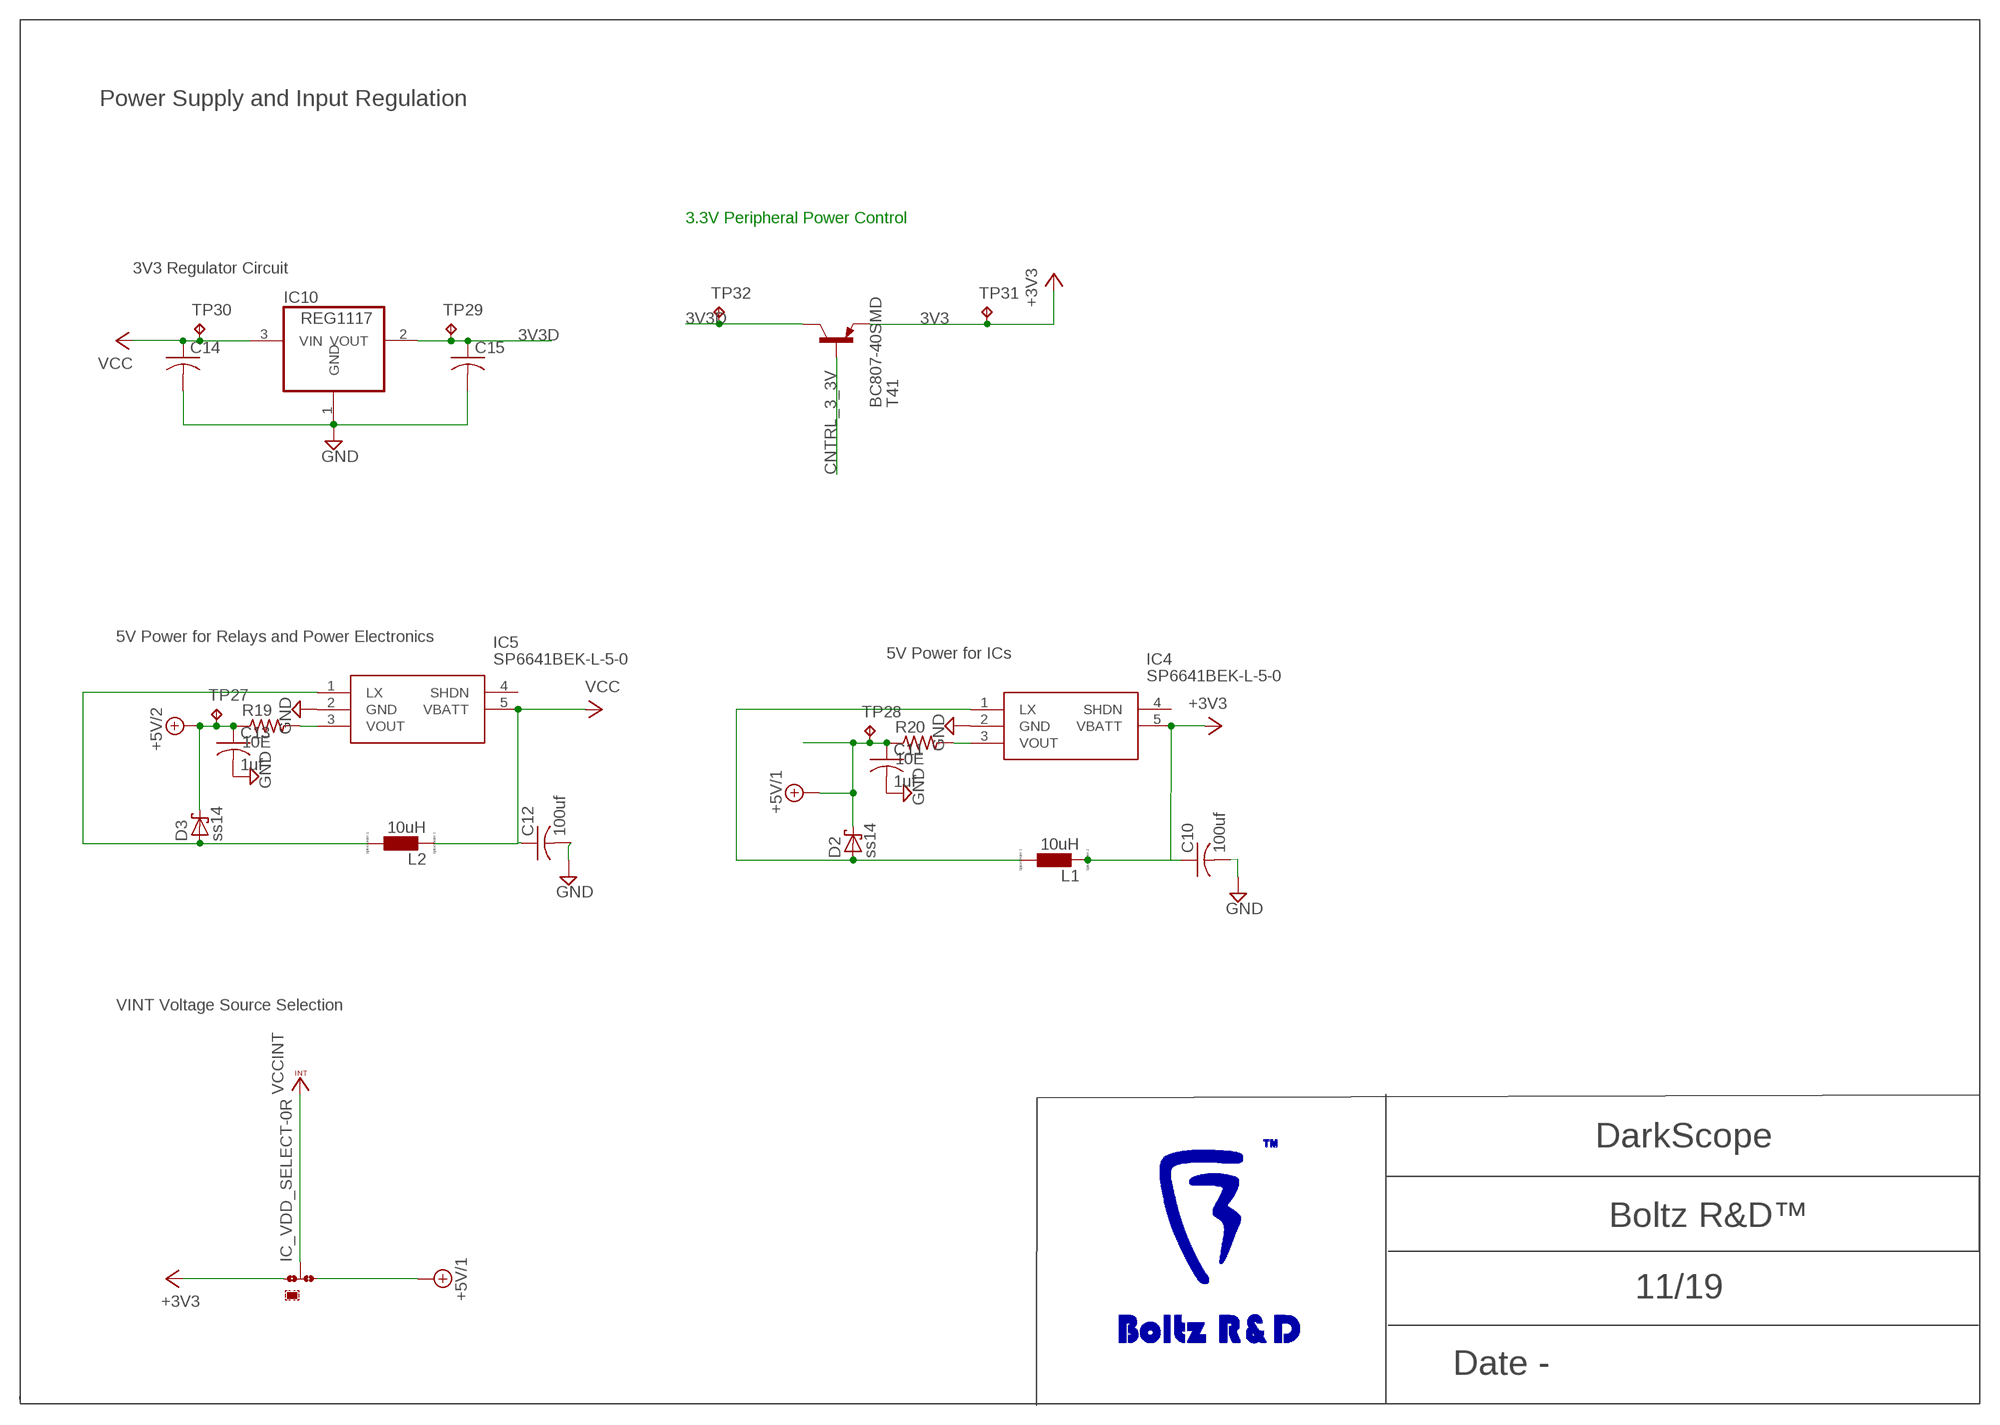
[diagram p7: schematic, sheet 11]

### Parts
C10  100uf  C-USC0603K  [C0603K]
C11  1uf  C-USC0603K  [C0603K]
C12  100uf  C-USC0603K  [C0603K]
C13  1uf  C-USC0603K  [C0603K]
C14  C-USC0603K  [C0603K]
C15  C-USC0603K  [C0603K]
D2  ss14  SCHOTTKY-DIODESMC  [SMC]
D3  ss14  SCHOTTKY-DIODESMC  [SMC]
IC4  SP6641BEK-L-5-0  SP6641BEK-L-3-3_TR  [SOT95P280X145-5N]
IC5  SP6641BEK-L-5-0  SP6641BEK-L-3-3_TR  [SOT95P280X145-5N]
IC10  REG1117  [SOT223]
IC_VDD_SELECT  0R-JUMPC  [C0R-JMP]
L1  10uH  L0204/7  [0204/7]
L2  10uH  L0204/7  [0204/7]
R19  10E  R-US_R0603  [R0603]
R20  10E  R-US_R0603  [R0603]
T41  BC807-40SMD  [SOT23-BEC]
TP27  TPTP07R  [TP07R]
TP28  TPTP07R  [TP07R]
TP29  TPTP07R  [TP07R]
TP30  TPTP07R  [TP07R]
TP31  TPTP07R  [TP07R]
TP32  TPTP07R  [TP07R]

### Nets
3V3: T41.E TP31.TP ; supply symbol labelled +3V3
3V3D: C15.1 IC10.2(VOUT) T41.C TP29.TP TP32.TP
+3V3: C10.1 IC4.5(VBATT) IC_VDD_SELECT.1 L1.2
+5V/1: C11.1 D2.C IC_VDD_SELECT.3 R20.1 TP28.TP ; also sheet 3
+5V/2: C13.1 D3.C R19.1 TP27.TP
CNTRL_3_3V: T41.B
GND: C10.2 C11.2 C12.2 C13.2 C14.2 C15.2 IC4.2(GND) IC5.2(GND) IC10.1(GND) ; also sheet 3,9,10
N$14: D2.A IC4.1(LX) L1.1
N$31: IC4.3(VOUT) R20.2
N$32: IC5.3(VOUT) R19.2
N$33: D3.A IC5.1(LX) L2.1
VCC: C12.1 C14.1 IC5.5(VBATT) IC10.3(VIN) L2.2 TP30.TP ; also sheet 9
VCCINT: IC_VDD_SELECT.2
Unconnected: IC4.4(SHDN) IC5.4(SHDN)

### Notes on the sheet
- Power Supply and Input Regulation
- 3.3V Peripheral Power Control
- 3V3 Regulator Circuit
- 5V Power for Relays and Power Electronics
- 5V Power for ICs
- VINT Voltage Source Selection

## Sheet 12 of 19
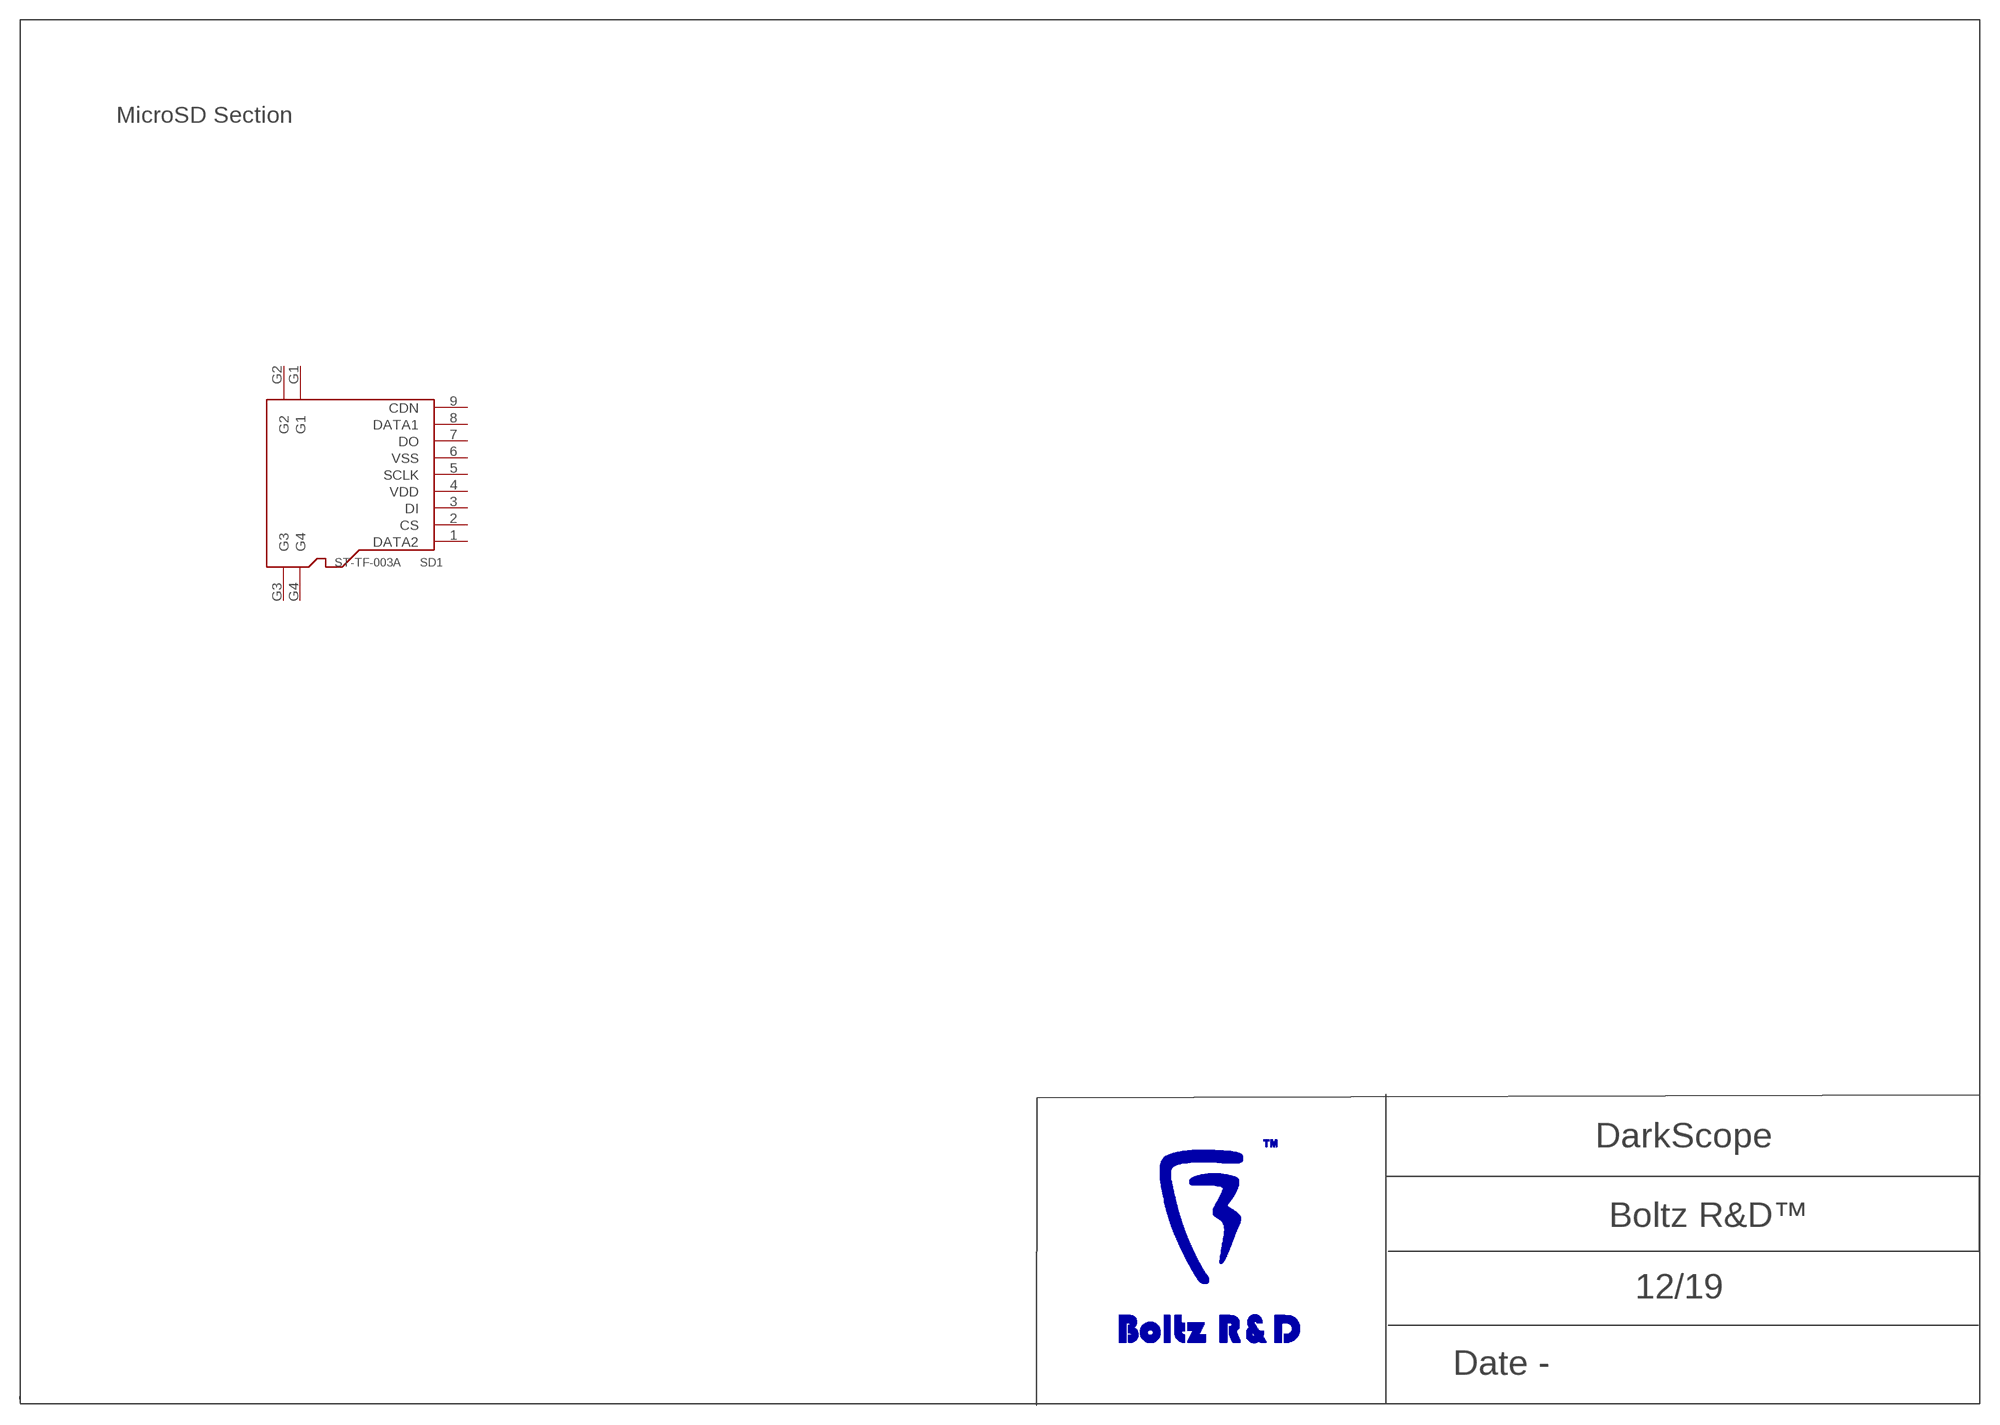
[diagram p8: schematic, sheet 12]

### Parts
SD1  ST-TF-003A  MICRO-SD-CARD-SOCKET-9P(ST-TF-003A)  [MICRO-SD9+4P-SMD-16.1X14.5X1.85MM]
Unconnected: SD1.1(DATA2) SD1.2(CS) SD1.3(DI) SD1.4(VDD) SD1.5(SCLK) SD1.6(VSS) SD1.7(DO) SD1.8(DATA1) SD1.9(CDN) SD1.G1 SD1.G2 SD1.G3 SD1.G4

### Notes on the sheet
- MicroSD Section

## Sheet 13 of 19
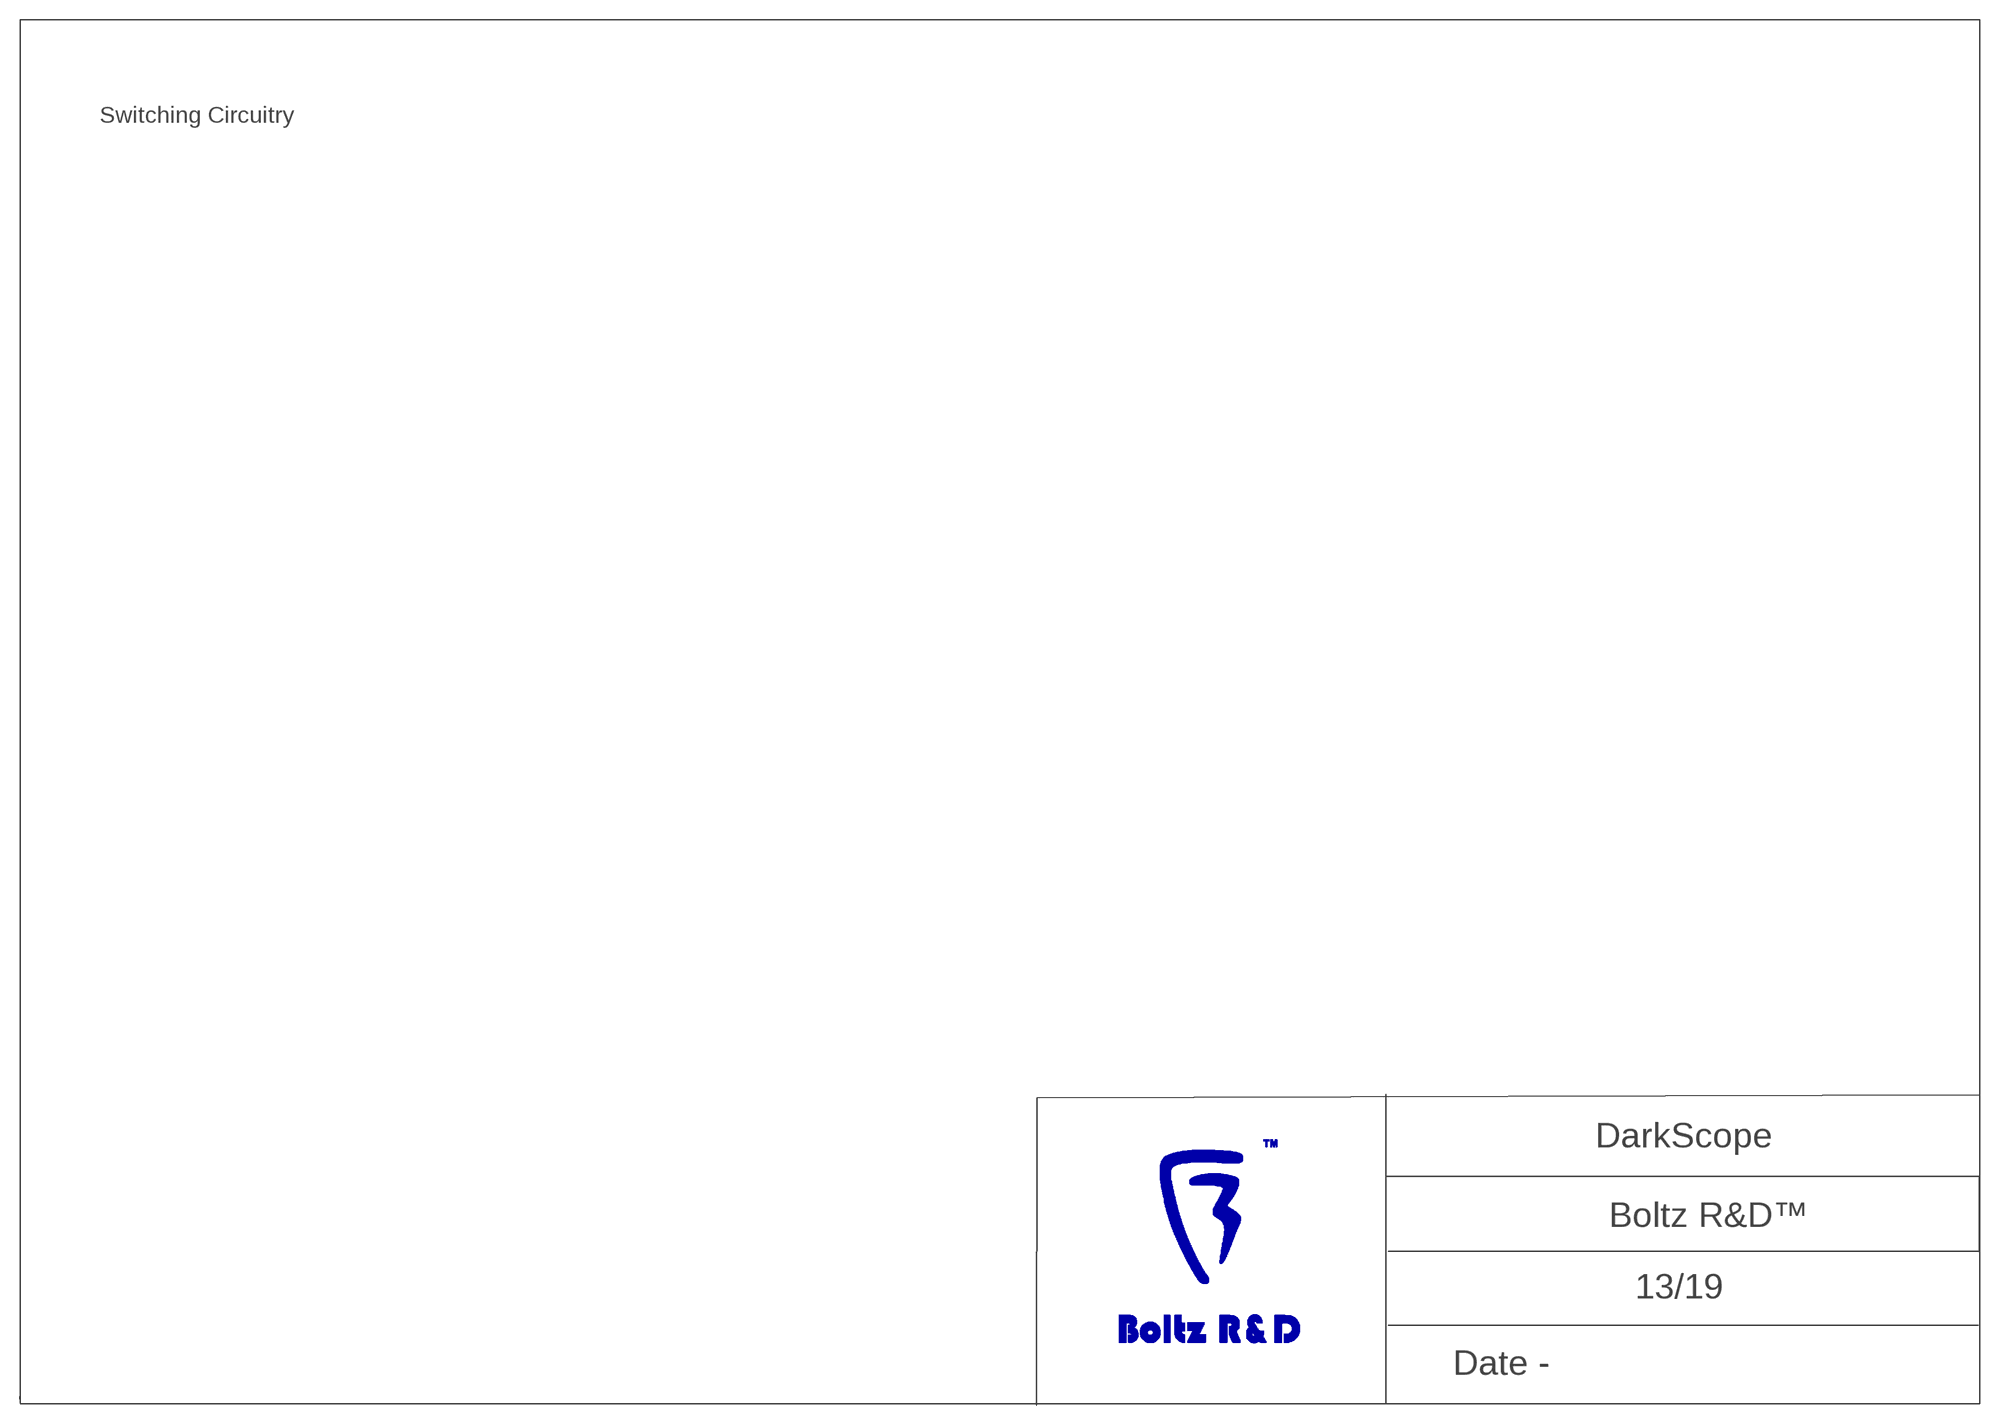
[diagram p9: schematic, sheet 13]

### Notes on the sheet
- Switching Circuitry

## Sheet 14 of 19
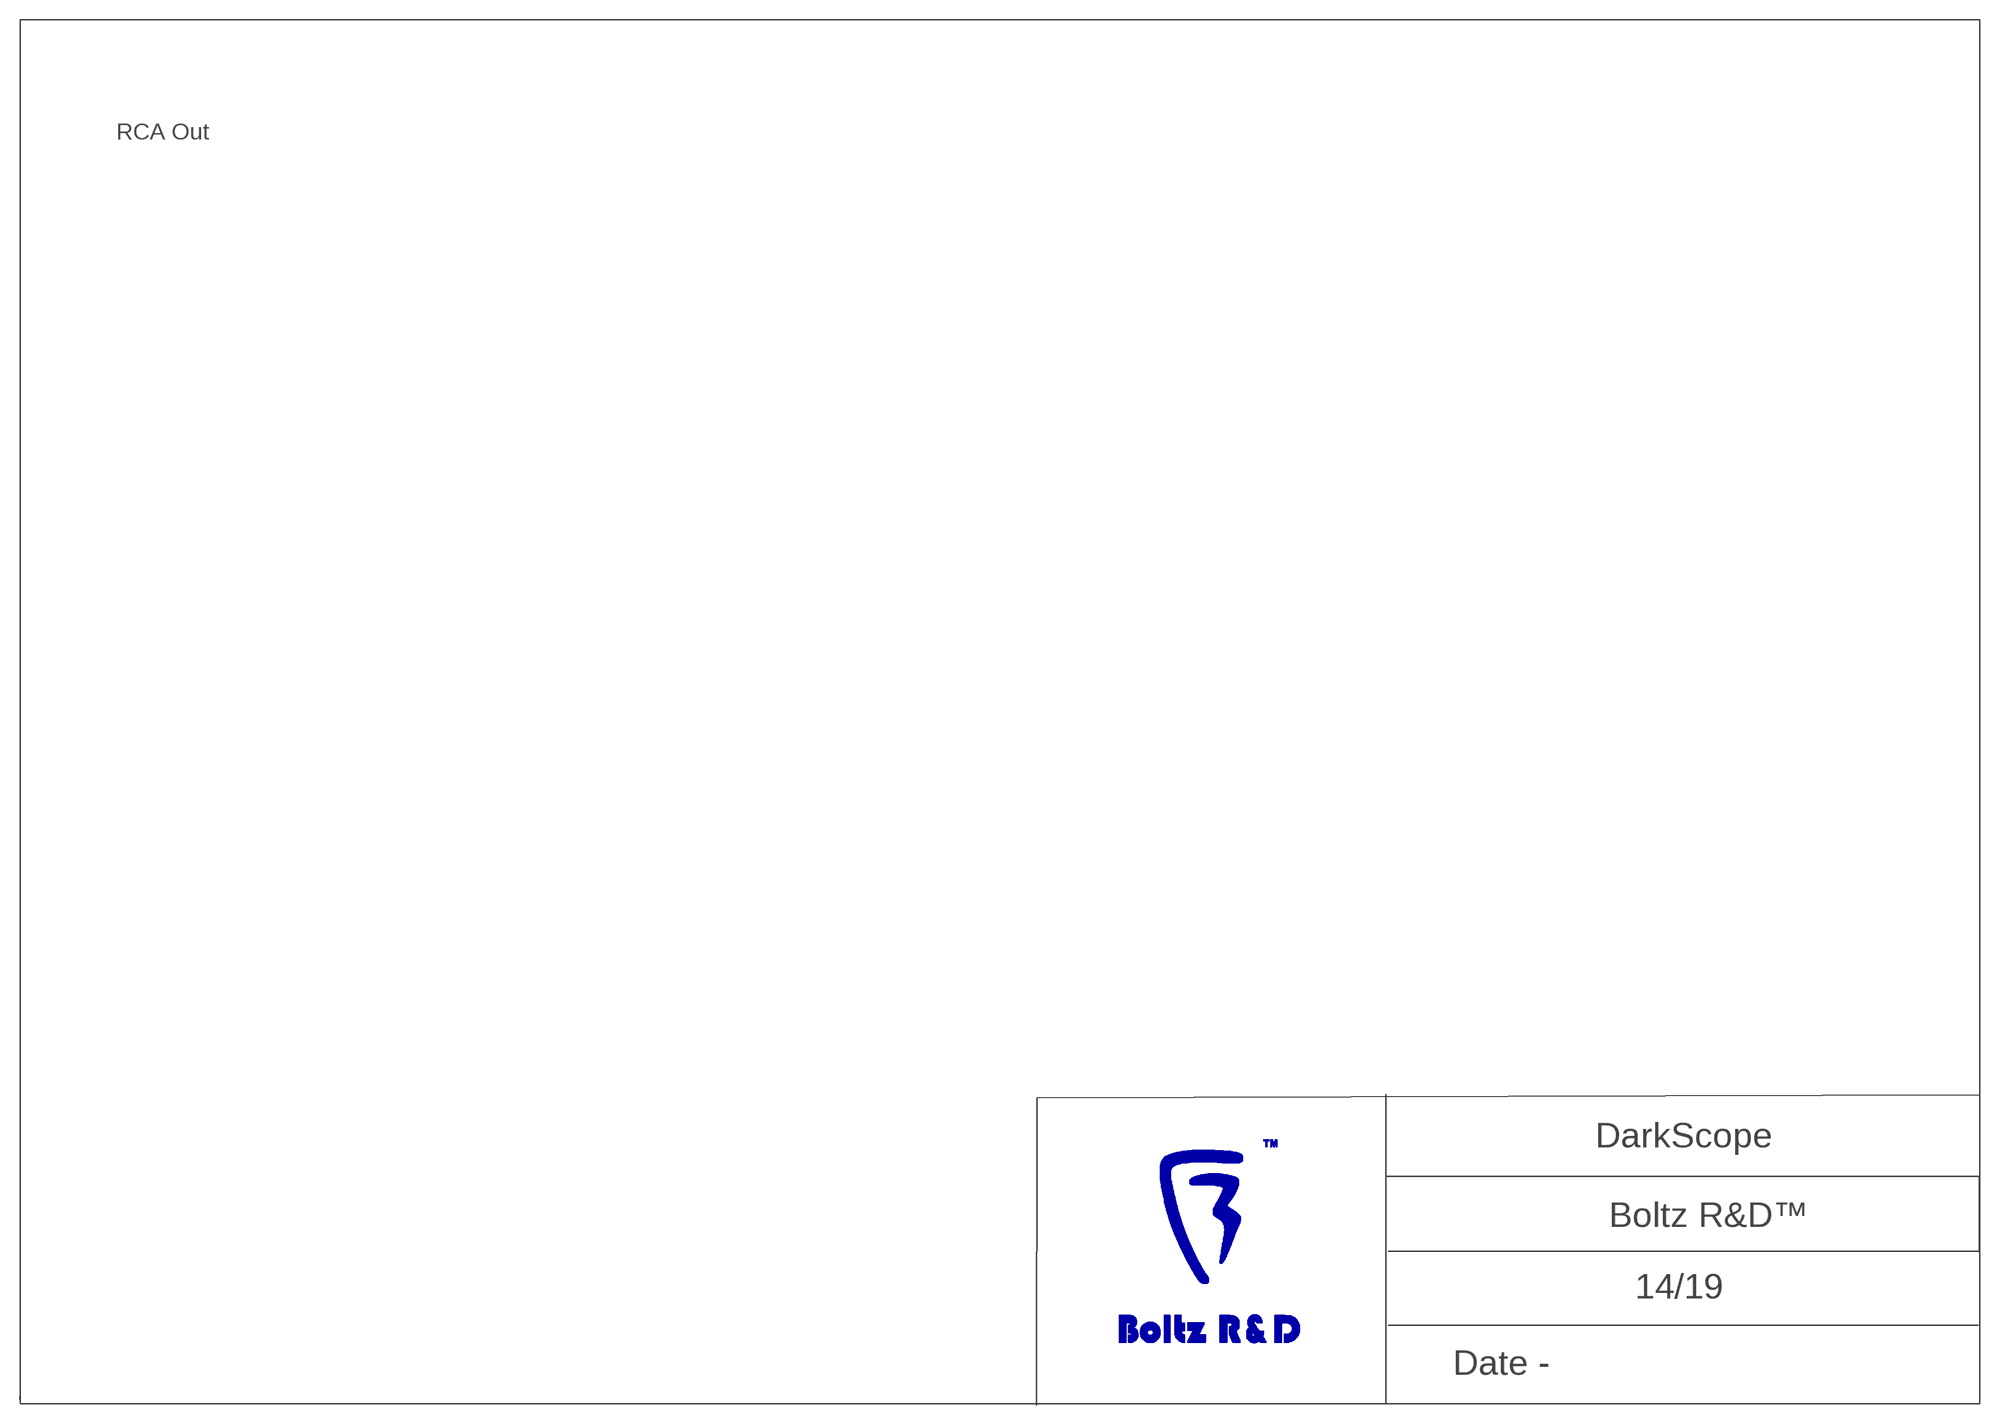
[diagram p10: schematic, sheet 14]

### Notes on the sheet
- RCA Out

## Sheet 15 of 19
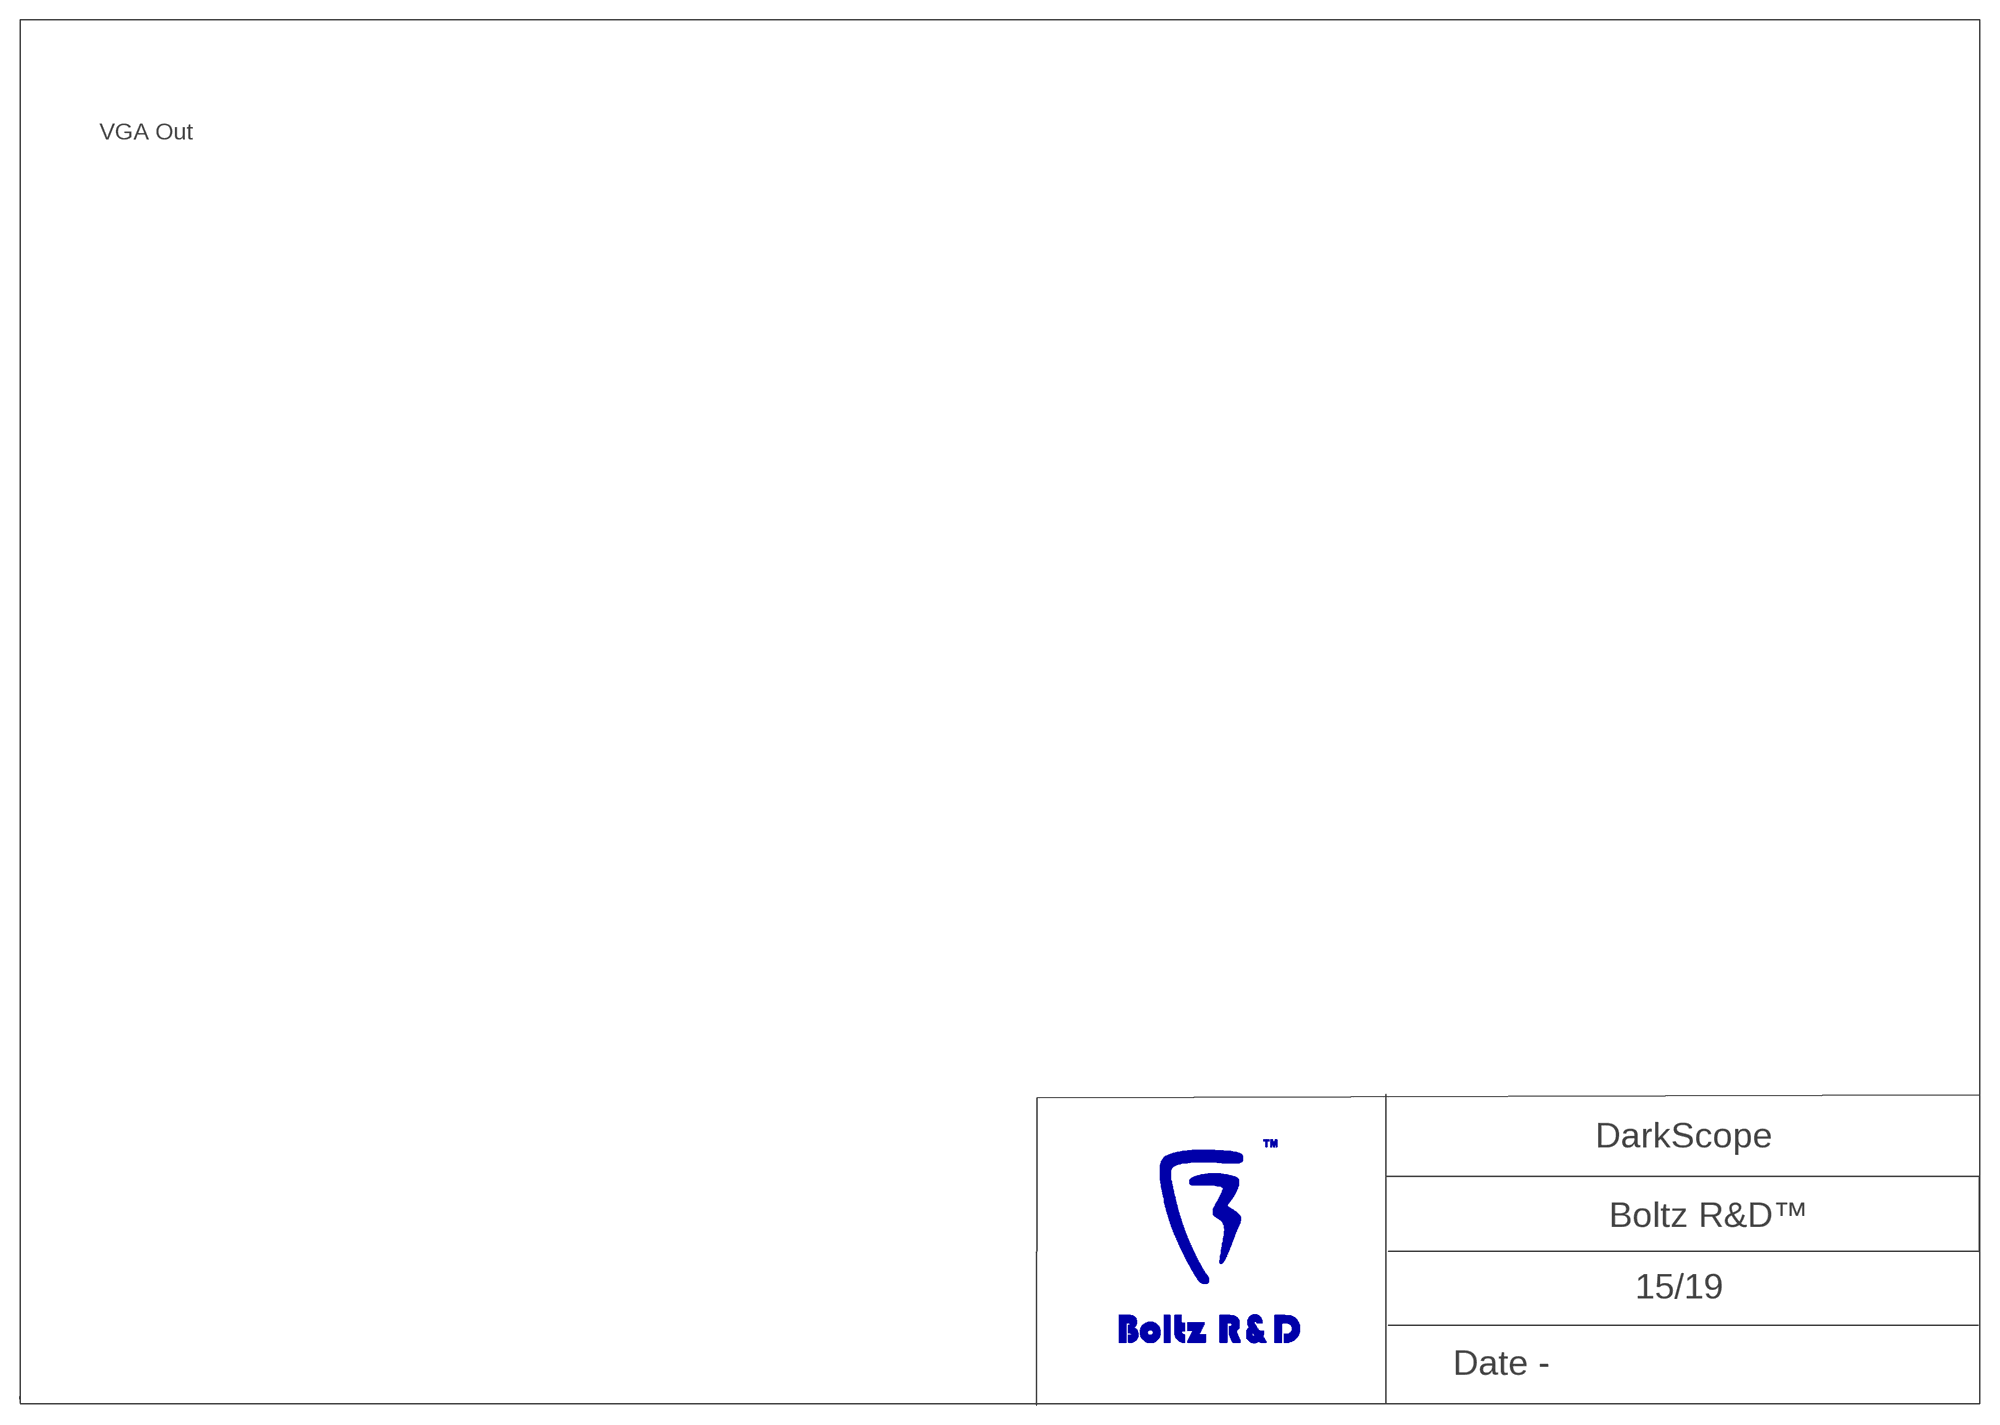
[diagram p11: schematic, sheet 15]

### Notes on the sheet
- VGA Out

## Sheet 16 of 19
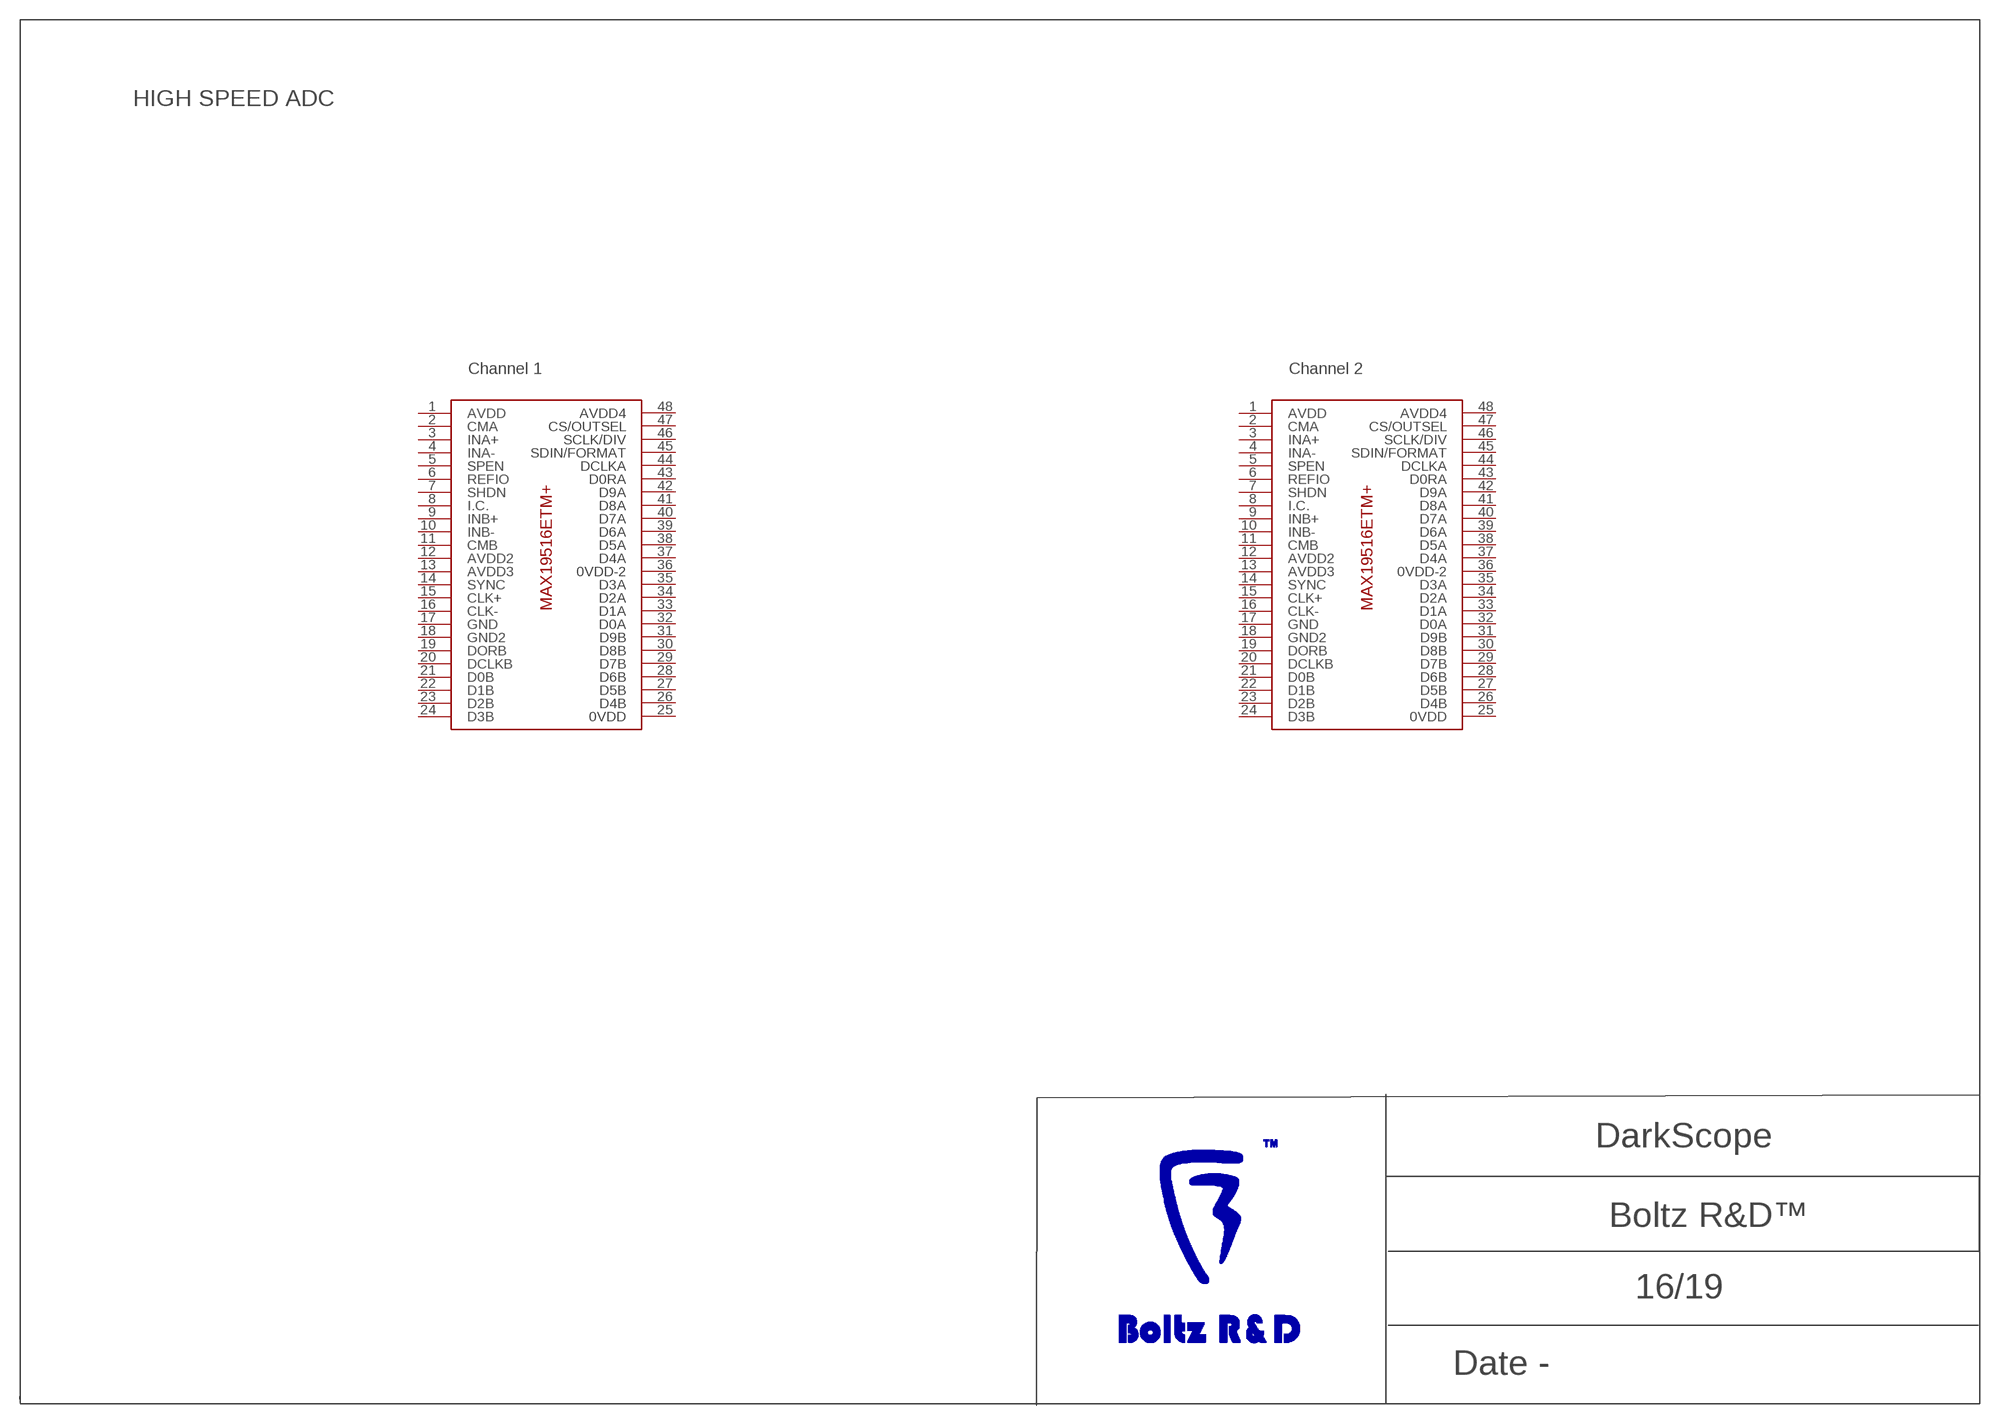
[diagram p12: schematic, sheet 16]

### Parts
U$20  MAX19516ETM+MAX19516ETM+  [QFN50P700X700X80-48]
U$21  MAX19516ETM+MAX19516ETM+  [QFN50P700X700X80-48]
Unconnected: U$20.1(AVDD) U$20.2(CMA) U$20.3(INA+) U$20.4(INA-) U$20.5(SPEN) U$20.6(REFIO) U$20.7(SHDN) U$20.8(I.C.) U$20.9(INB+) U$20.10(INB-) U$20.11(CMB) U$20.12(AVDD2) U$20.13(AVDD3) U$20.14(SYNC) U$20.15(CLK+) U$20.16(CLK-) U$20.17(GND) U$20.18(GND2) U$20.19(DORB) U$20.20(DCLKB) U$20.21(D0B) U$20.22(D1B) U$20.23(D2B) U$20.24(D3B) U$20.25(0VDD) U$20.26(D4B) U$20.27(D5B) U$20.28(D6B) U$20.29(D7B) U$20.30(D8B) U$20.31(D9B) U$20.32(D0A) U$20.33(D1A) U$20.34(D2A) U$20.35(D3A) U$20.36(0VDD-2) U$20.37(D4A) U$20.38(D5A) U$20.39(D6A) U$20.40(D7A) U$20.41(D8A) U$20.42(D9A) U$20.43(D0RA) U$20.44(DCLKA) U$20.45(SDIN/FORMAT) U$20.46(SCLK/DIV) U$20.47(CS/OUTSEL) U$20.48(AVDD4) U$21.1(AVDD) U$21.2(CMA) U$21.3(INA+) U$21.4(INA-) U$21.5(SPEN) U$21.6(REFIO) U$21.7(SHDN) U$21.8(I.C.) U$21.9(INB+) U$21.10(INB-) U$21.11(CMB) U$21.12(AVDD2) U$21.13(AVDD3) U$21.14(SYNC) U$21.15(CLK+) U$21.16(CLK-) U$21.17(GND) U$21.18(GND2) U$21.19(DORB) U$21.20(DCLKB) U$21.21(D0B) U$21.22(D1B) U$21.23(D2B) U$21.24(D3B) U$21.25(0VDD) U$21.26(D4B) U$21.27(D5B) U$21.28(D6B) U$21.29(D7B) U$21.30(D8B) U$21.31(D9B) U$21.32(D0A) U$21.33(D1A) U$21.34(D2A) U$21.35(D3A) U$21.36(0VDD-2) U$21.37(D4A) U$21.38(D5A) U$21.39(D6A) U$21.40(D7A) U$21.41(D8A) U$21.42(D9A) U$21.43(D0RA) U$21.44(DCLKA) U$21.45(SDIN/FORMAT) U$21.46(SCLK/DIV) U$21.47(CS/OUTSEL) U$21.48(AVDD4)

### Notes on the sheet
- HIGH SPEED ADC
- Channel 1 | Channel 2

## Sheet 17 of 19
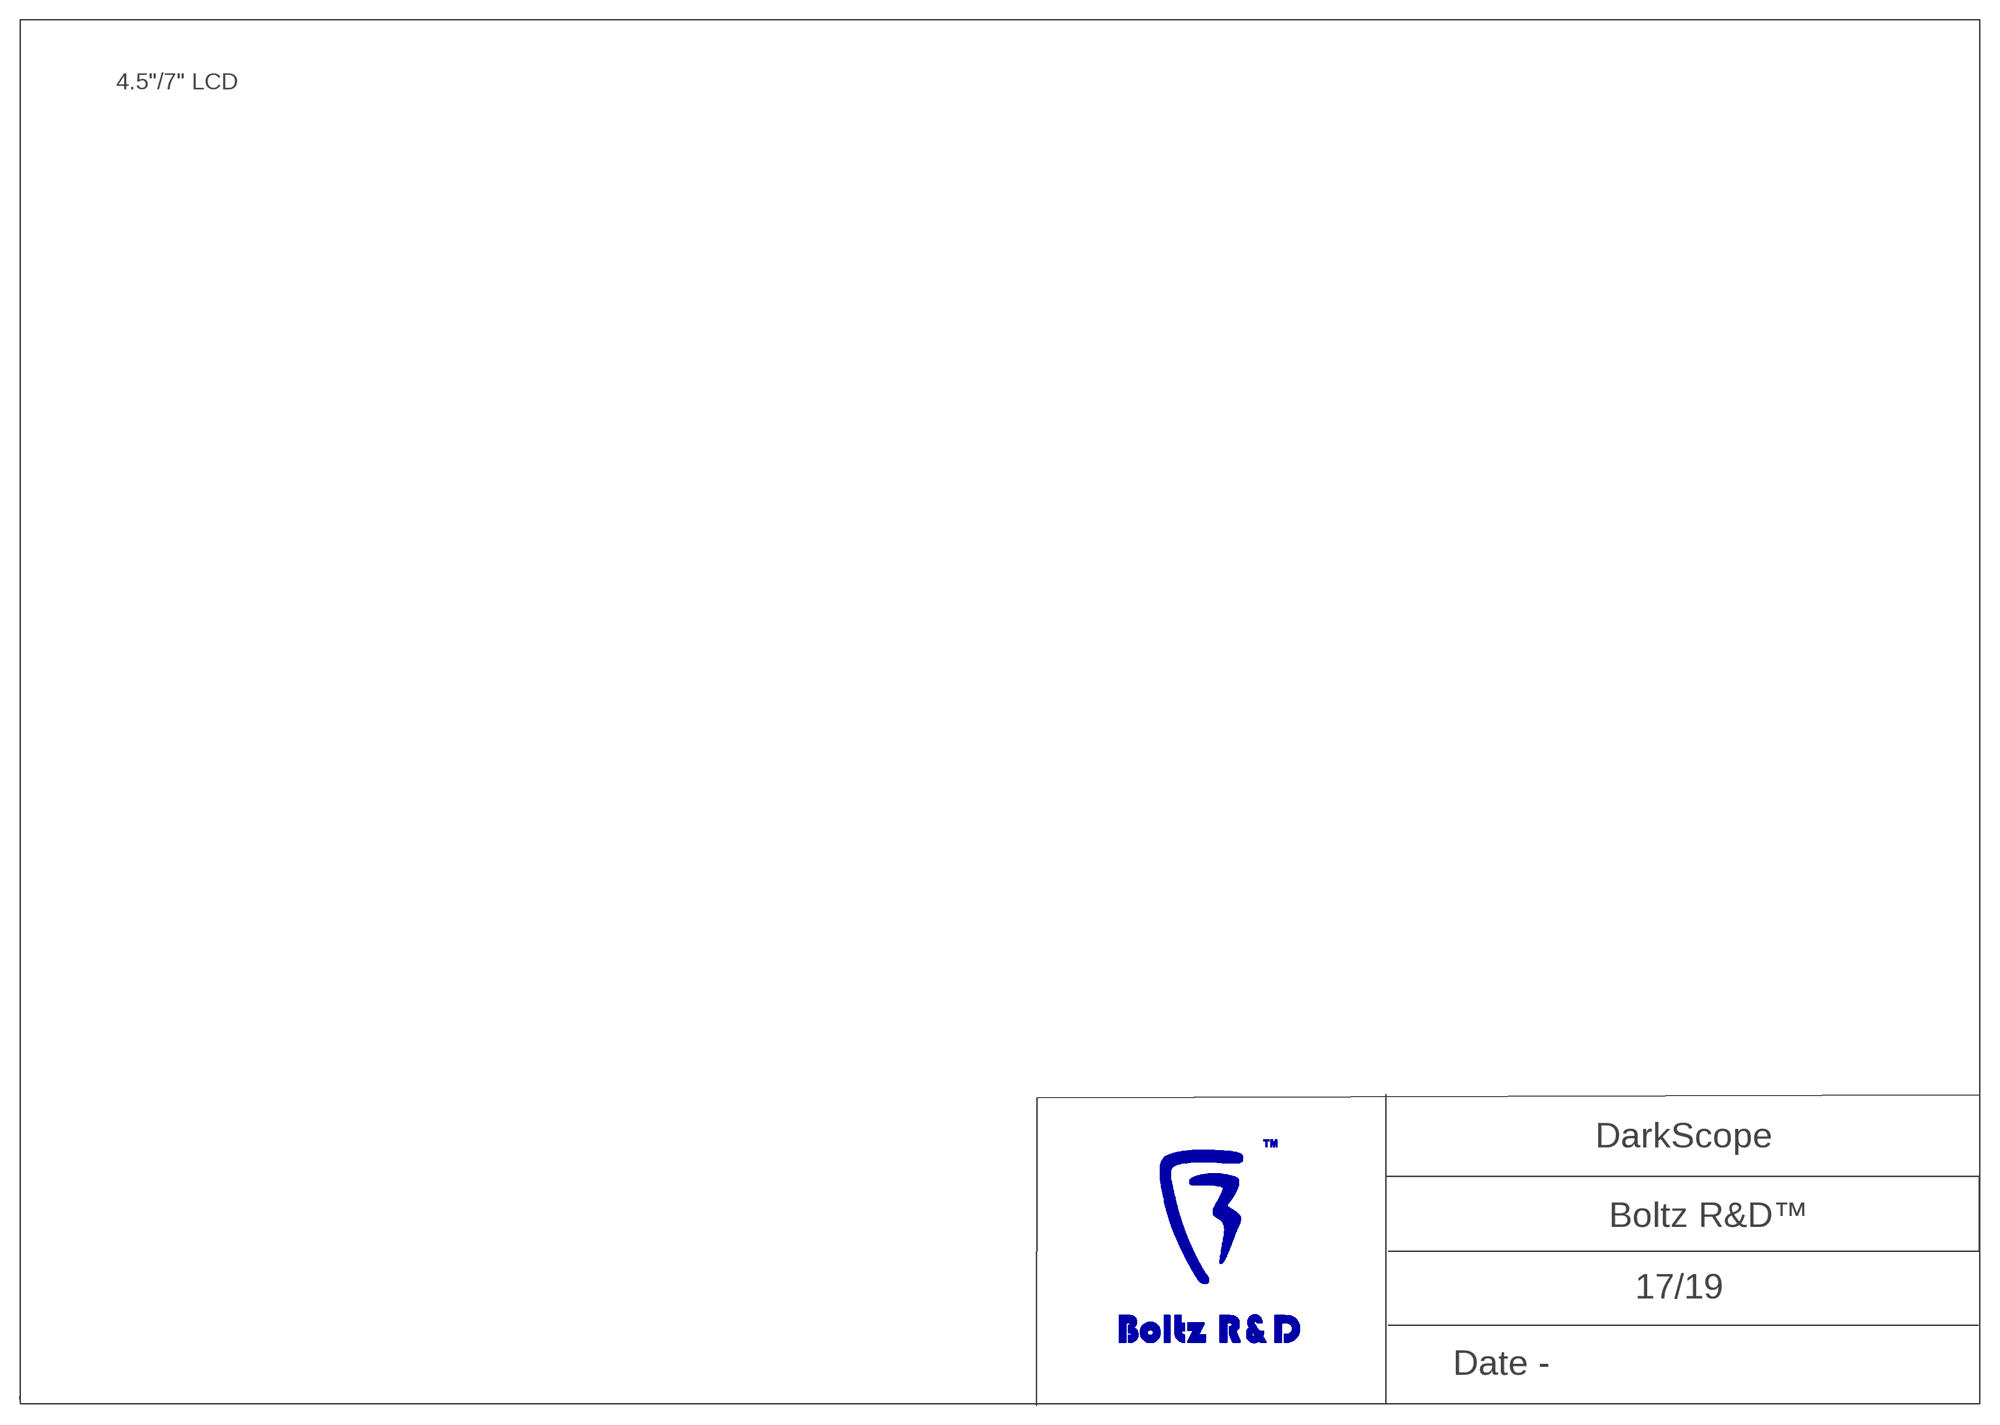
[diagram p13: schematic, sheet 17]

### Notes on the sheet
- 4.5"/7" LCD

## Sheet 18 of 19
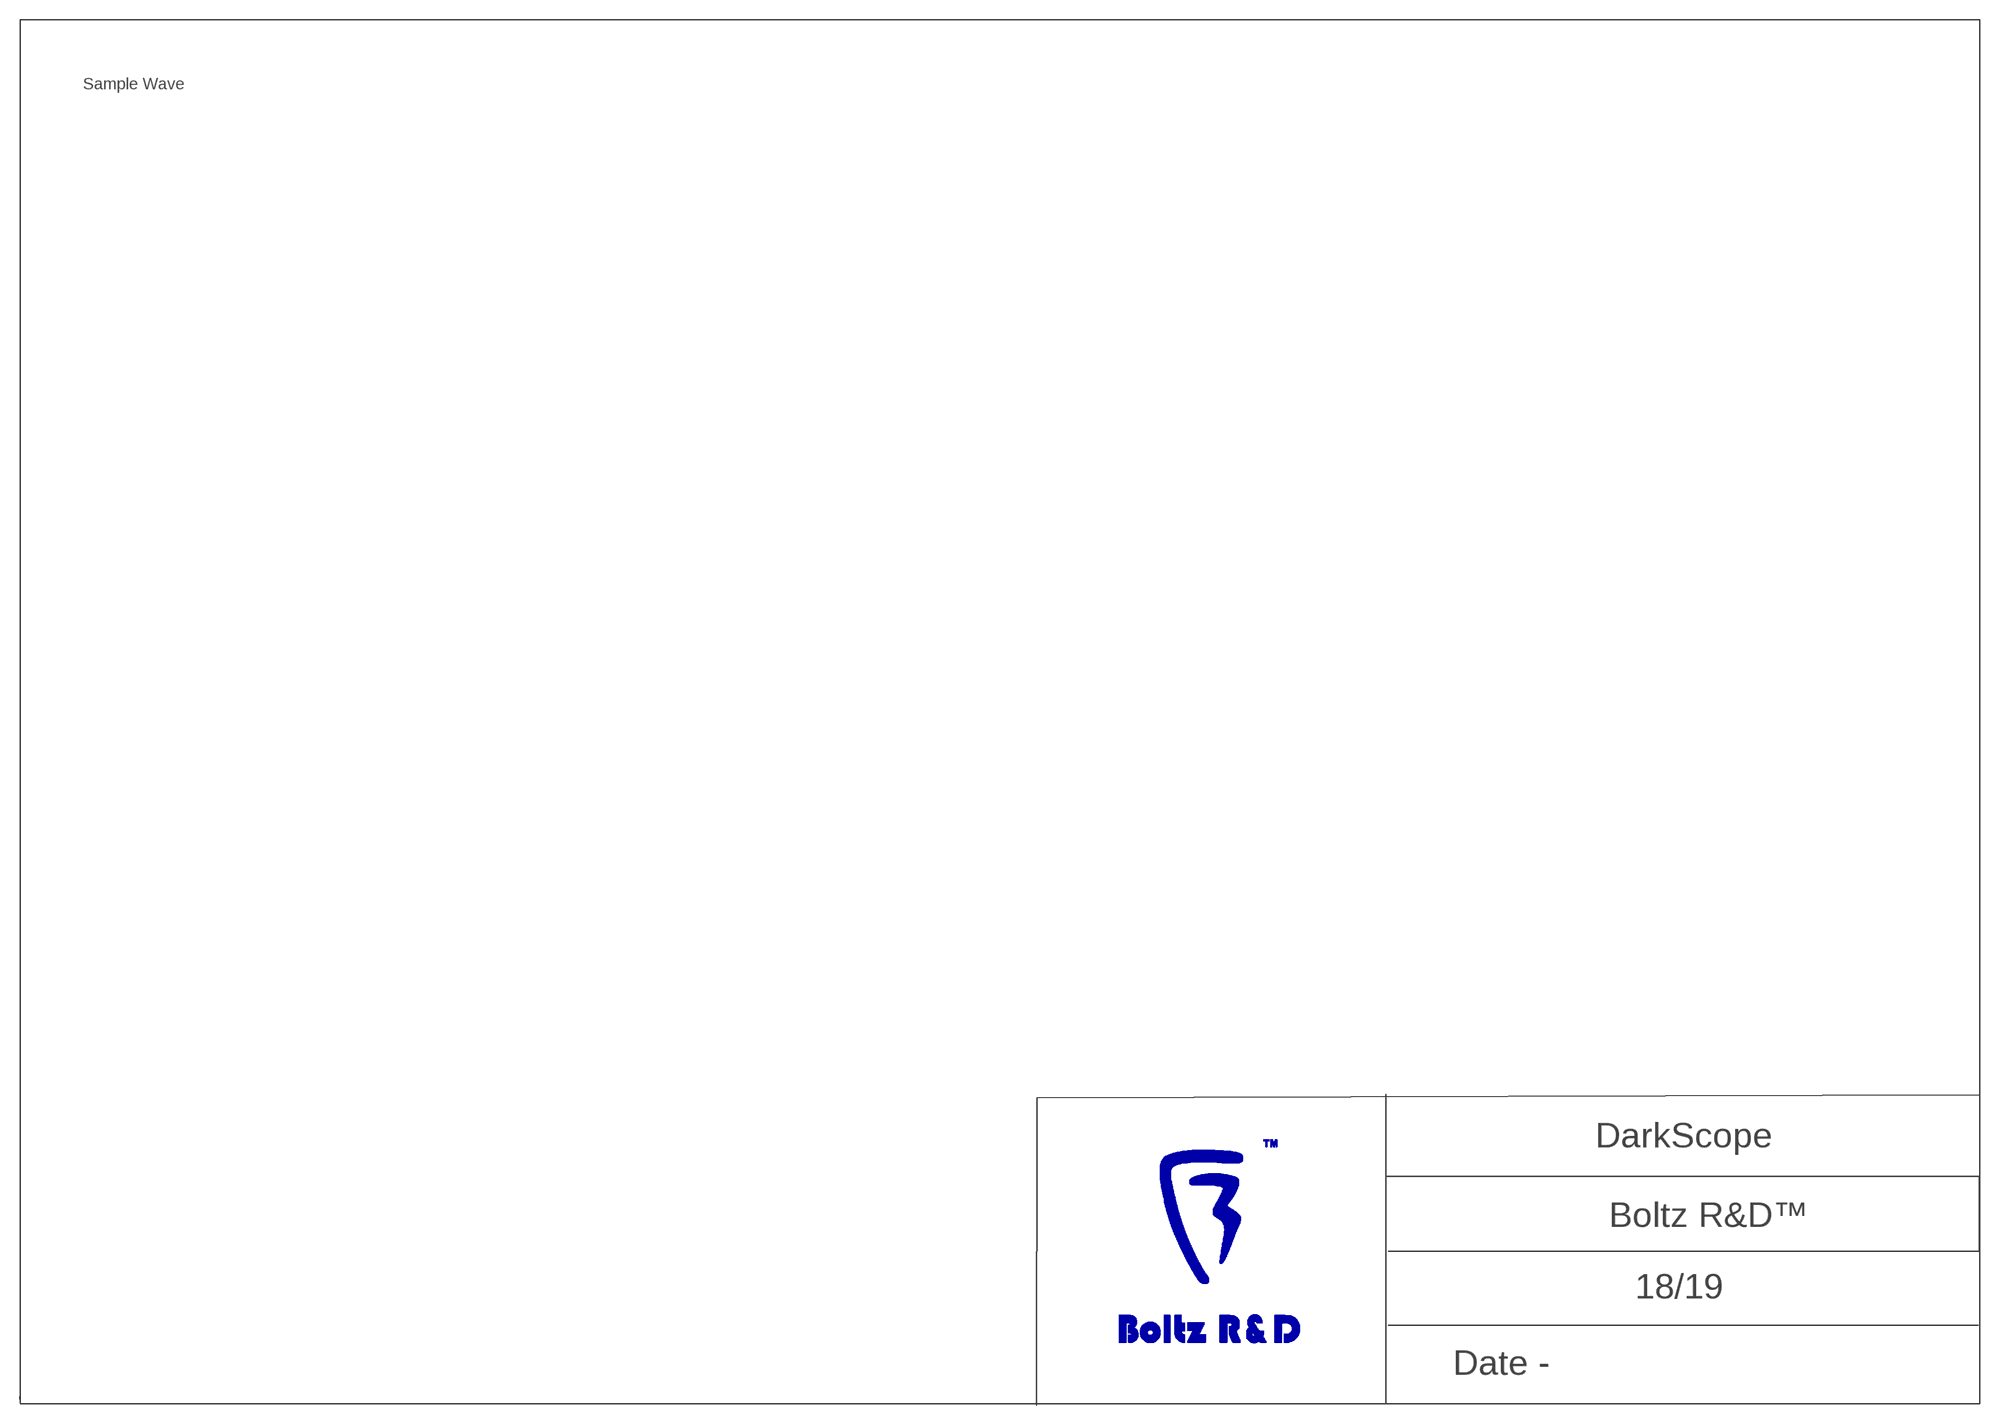
[diagram p14: schematic, sheet 18]

### Notes on the sheet
- Sample Wave

## Sheet 19 of 19
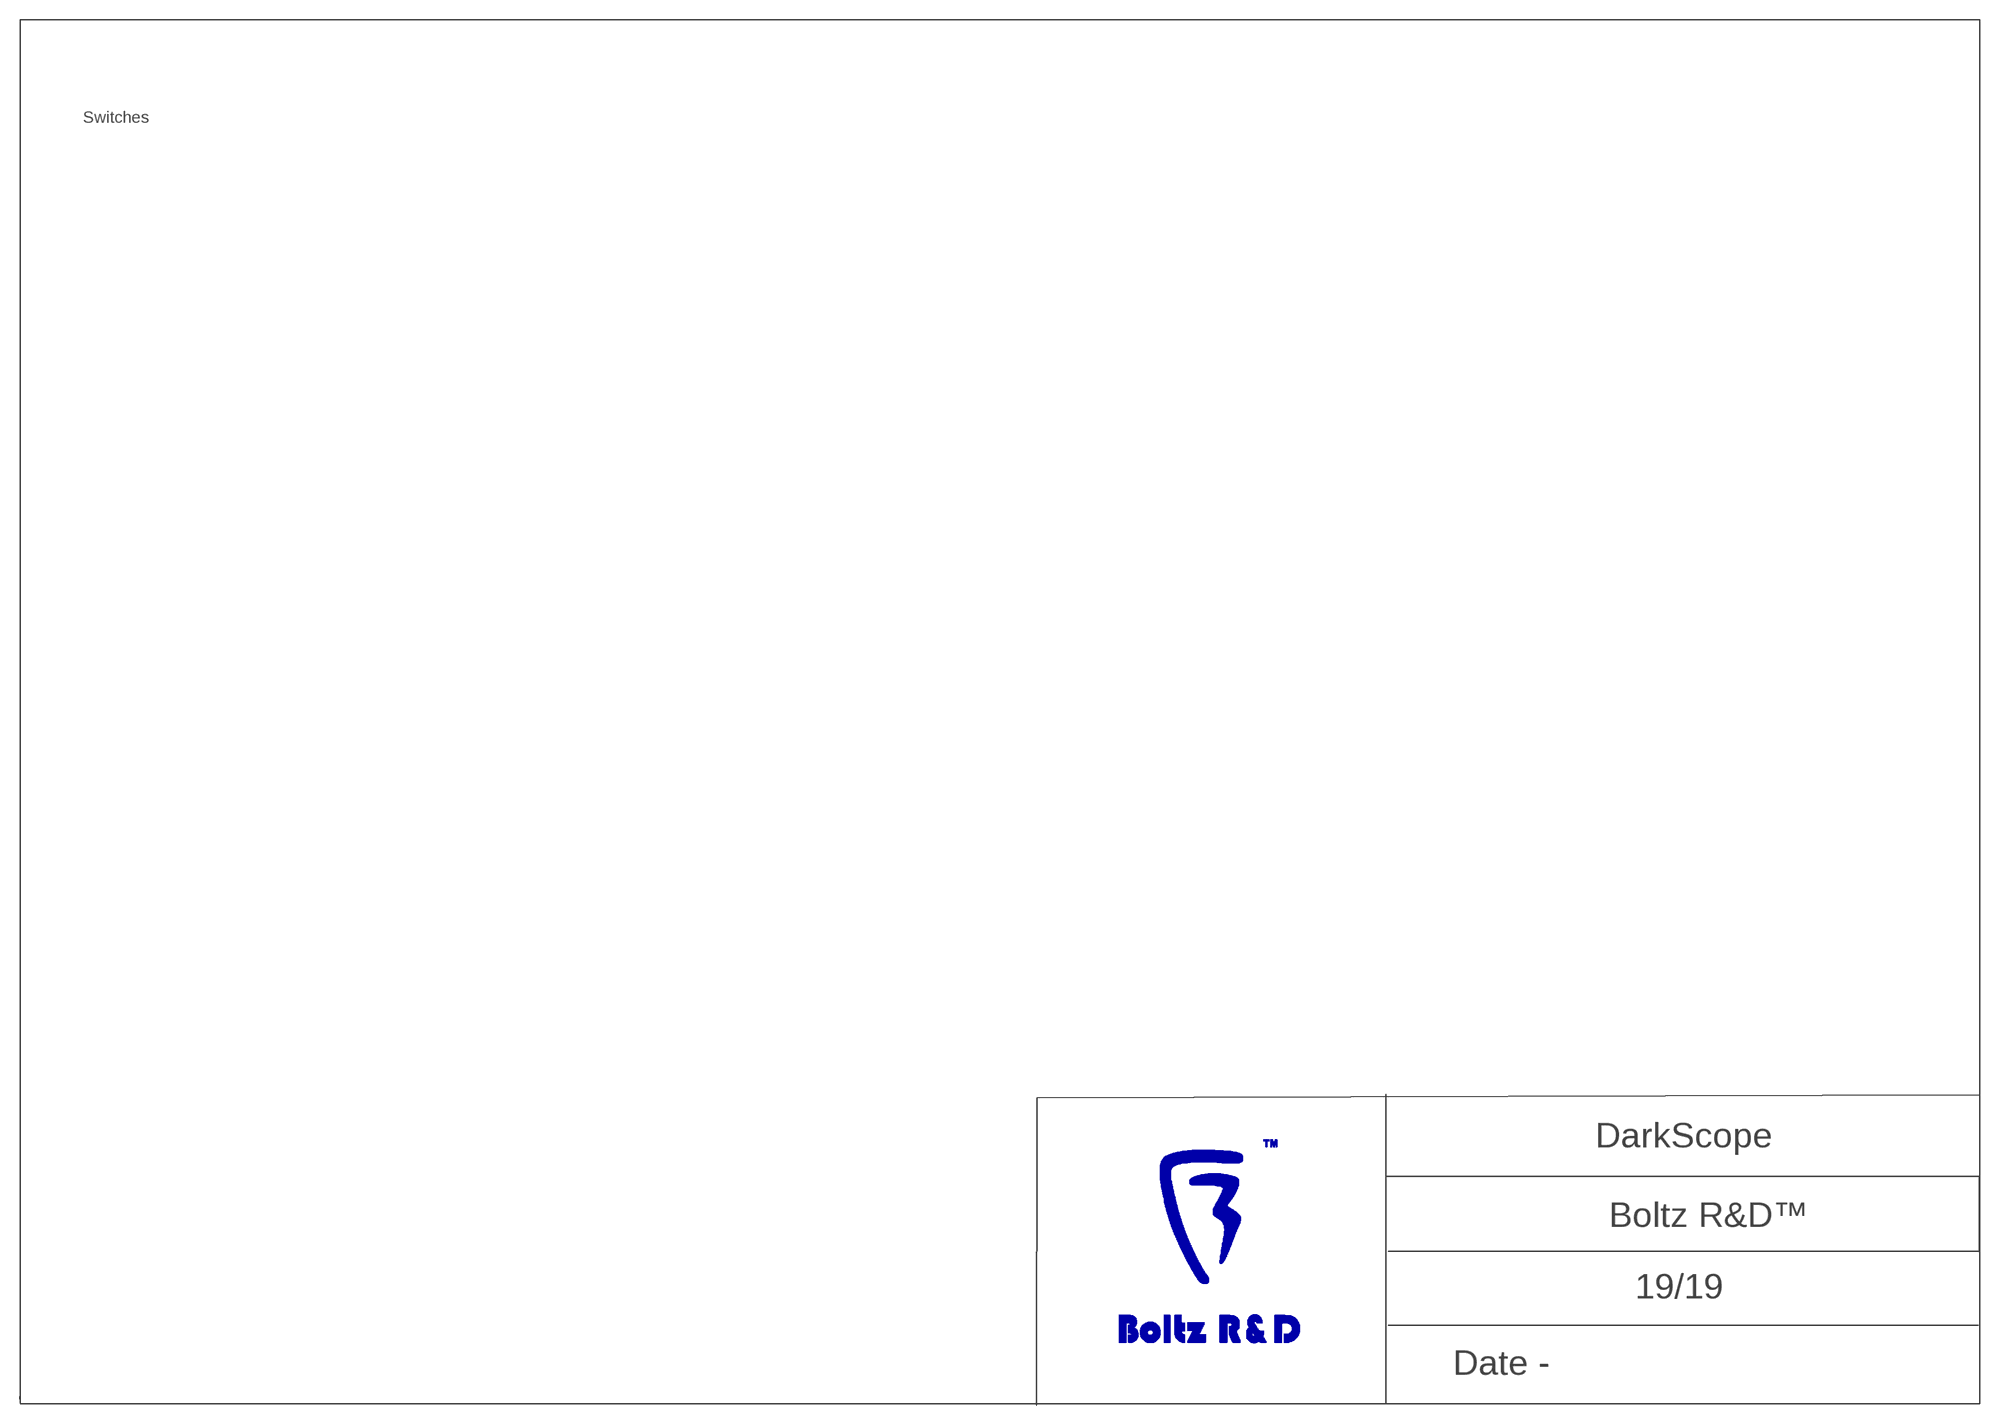
[diagram p15: schematic, sheet 19]

### Notes on the sheet
- Switches

## Power pins joined to a net without a drawn wire
GND1: IC1.44(GND1)
GND2: IC1.61(GND2)
GND3: IC1.95(GND3)
GND4: IC1.115(GND4)
GND5: IC1.135(GND5)
GND6: IC1.138(GND6)
VDDCORE1: IC1.29(VDDCORE1)
VDDCORE2: IC1.33(VDDCORE2)
VDDCORE3: IC1.50(VDDCORE3)
VDDCORE4: IC1.81(VDDCORE4)
VDDCORE5: IC1.107(VDDCORE5)
VDDIN: IC1.5(VDDIN)
VDDIO1: IC1.30(VDDIO1)
VDDIO2: IC1.43(VDDIO2)
VDDIO3: IC1.72(VDDIO3)
VDDIO4: IC1.80(VDDIO4)
VDDIO5: IC1.96(VDDIO5)
VDDOUT: IC1.3(VDDOUT)
VDDPLL: IC1.123(VDDPLL)
VDDPLLUSB: IC1.143(VDDPLLUSB)
VDDUTMIC: IC1.139(VDDUTMIC)
VDDUTMII: IC1.134(VDDUTMII)

## Library data of the parts
C1-C4 C7-C9 = rcl:C-EU: CAPACITOR, European symbol; SPICEPREFIX: C
C5 C6 = rcl:C-TRIMM: Trimm capacitor; SPICEPREFIX: C
C10-C13 = resistor:C-US: CAPACITOR, American symbol
C14 C15 C37 = rcl:C-US: CAPACITOR, American symbol; SPICEPREFIX: C
D2 D3 = diode:SCHOTTKY-DIODE: Schottky Diode
D5 D6 = eagle-ltspice:SCHOTTKY-DIODE: Schottky Diode; SPICEMODEL: NONE; SPICEPREFIX: D; SPICETYPE: diode
D7 = diode:ZENER-DIODE: Z-Diode
IC1 = SamacSys_Parts:ATSAME70Q21A-AN: ATMEL - ATSAME70Q21A-AN - MCU, 32BIT, CORTEX-M7, 300MHZ, LQFP-144 Source: Datasheet <http://www.atmel.com/Images/Atmel-11296-32-bit-Cortex-M7-Microcontroller-SAM-E70Q-SAM-E70N-SAM-E70J_Datasheet.pdf>; ARROW_PART_NUMBER: ATSAME70Q21A-AN; ARROW_PRICE/STOCK: https://www.arrow.com/en/products/atsame70q21a-an/microchip-technology; DESCRIPTION: ATMEL - ATSAME70Q21A-AN - MCU, 32BIT, CORTEX-M7, 300MHZ, LQFP-144; HEIGHT: 1.6mm; MANUFACTURER_NAME: Microchip; MANUFACTURER_PART_NUMBER: ATSAME70Q21A-AN; RS_PART_NUMBER: 1463226; RS_PRICE/STOCK: http://uk.rs-online.com/web/p/products/1463226
IC3 IC9 = SamacSys_Parts:TLE2082ID: TLE2082ID, Dual Operational Amplifier 9.4MHz, 8-Pin SOIC Source: Datasheet <http://www.ti.com/lit/ds/symlink/tle2082.pdf>; ARROW_PART_NUMBER: TLE2082ID; ARROW_PRICE/STOCK: https://www.arrow.com/en/products/tle2082id/texas-instruments; DESCRIPTION: TLE2082ID, Dual Operational Amplifier 9.4MHz, 8-Pin SOIC; HEIGHT: 1.75mm; MANUFACTURER_NAME: Texas Instruments; MANUFACTURER_PART_NUMBER: TLE2082ID; RS_PART_NUMBER: 3570120P; RS_PRICE/STOCK: http://uk.rs-online.com/web/p/products/3570120P
IC4 IC5 = SamacSys_Parts:SP6641BEK-L-3-3_TR: Voltage Regulators - Switching Regulators 100mA Alkaline DC/DC Source: Datasheet <https://componentsearchengine.com/Datasheets/1/SP6641BEK-L-3-3_TR.pdf>; ARROW_PART_NUMBER: SP6641BEK-L-3-3/TR; ARROW_PRICE/STOCK: https://www.arrow.com/en/products/sp6641bek-l-3-3tr/exar; DESCRIPTION: Voltage Regulators - Switching Regulators 100mA Alkaline DC/DC; HEIGHT: 1.45mm; MANUFACTURER_NAME: EXAR; MANUFACTURER_PART_NUMBER: SP6641BEK-L-3-3/TR
IC6 IC7 = SamacSys_Parts:AT45DB161E-SSHD-T: Flash Memory 16M 2.5-3.6V 85Mhz Data Flash Source: Datasheet <http://www.adestotech.com/wp-content/uploads/doc8782.pdf>; ARROW_PART_NUMBER: AT45DB161E-SSHD-T; ARROW_PRICE/STOCK: https://www.arrow.com/en/products/at45db161e-sshd-t/adesto-technologies-corporation-inc; DESCRIPTION: Flash Memory 16M 2.5-3.6V 85Mhz Data Flash; HEIGHT: 1.75mm; MANUFACTURER_NAME: Adesto Technologies; MANUFACTURER_PART_NUMBER: AT45DB161E-SSHD-T
IC8 = SamacSys_Parts:MCP73871-2CAI_ML: Li-Ion Charger USB/DC 4.2V 1A TE QFN20 Source: Datasheet <http://ww1.microchip.com/downloads/en/DeviceDoc/20002090C.pdf>; ALLIED_NUMBER: 70046852; ALLIED_PRICE/STOCK: http://www.alliedelec.com/microchip-technology-inc-mcp73871-2cai-ml/70046852/; ARROW_PART_NUMBER: MCP73871-2CAI/ML; ARROW_PRICE/STOCK: https://www.arrow.com/en/products/mcp73871-2caiml/microchip-technology; DESCRIPTION: Li-Ion Charger USB/DC 4.2V 1A TE QFN20; HEIGHT: 1mm; MANUFACTURER_NAME: Microchip; MANUFACTURER_PART_NUMBER: MCP73871-2CAI/ML; RS_PART_NUMBER: 1460132; RS_PRICE/STOCK: http://uk.rs-online.com/web/p/products/1460132
IC10 = burr-brown:REG1117: 800mA and 1A Low Dropout (LDO) Positive Regulator 1.8V, 2.5V, 2.85V, 3.3V, 5V, and Adj; MPN: REG1117; OC_FARNELL: 1097566; OC_NEWARK: 14P6981
IC_VDD_SELECT JMP1 = jump-0r-smd:0R-JUMP: SMD 0R 0805 Jumper
L1 L2 = eagle-ltspice:L: INDUCTOR, European symbol; SPICEMODEL: NONE; SPICEPREFIX: L
NTC PROG1 PROG2 R1-R23 R74-R77 = rcl:R-US_: RESISTOR, American symbol; SPICEPREFIX: R
SD1 = Seeed-Connector:MICRO-SD-CARD-SOCKET-9P(ST-TF-003A): 320090000; MPN: ST-TF-003A
SJ1 = jumper:SJ: SMD solder JUMPER
T1-T10 T41 = transistor-pnp:BC807*: PNP Transistror
TP1-TP32 = testpad:TP: Test pad
U$20 U$21 = Boltz_RnD:MAX19516ETM+
U$22 U$23 = Boltz_RnD:CY62167DV30LL
USB1 = Seeed-Connector:MICRO-USB-SMD(ZX62-B-5PA): 320010005; MPN: ZX62-B-5PA
VBAT+ VBAT-/GND = wirepad:SMD5: SMD PAD
X1 = con-coax:?227161*: JACK, RIGHT ANGLE, 50 OHM, PCB, BNC Source: amp_227161.pdf; MF: TYCO ELECTRONICS; MPN: 1-227161; OC_FARNELL: unknown; OC_NEWARK: 33B3200